# Altium project Elevate_pcb.PrjPcb
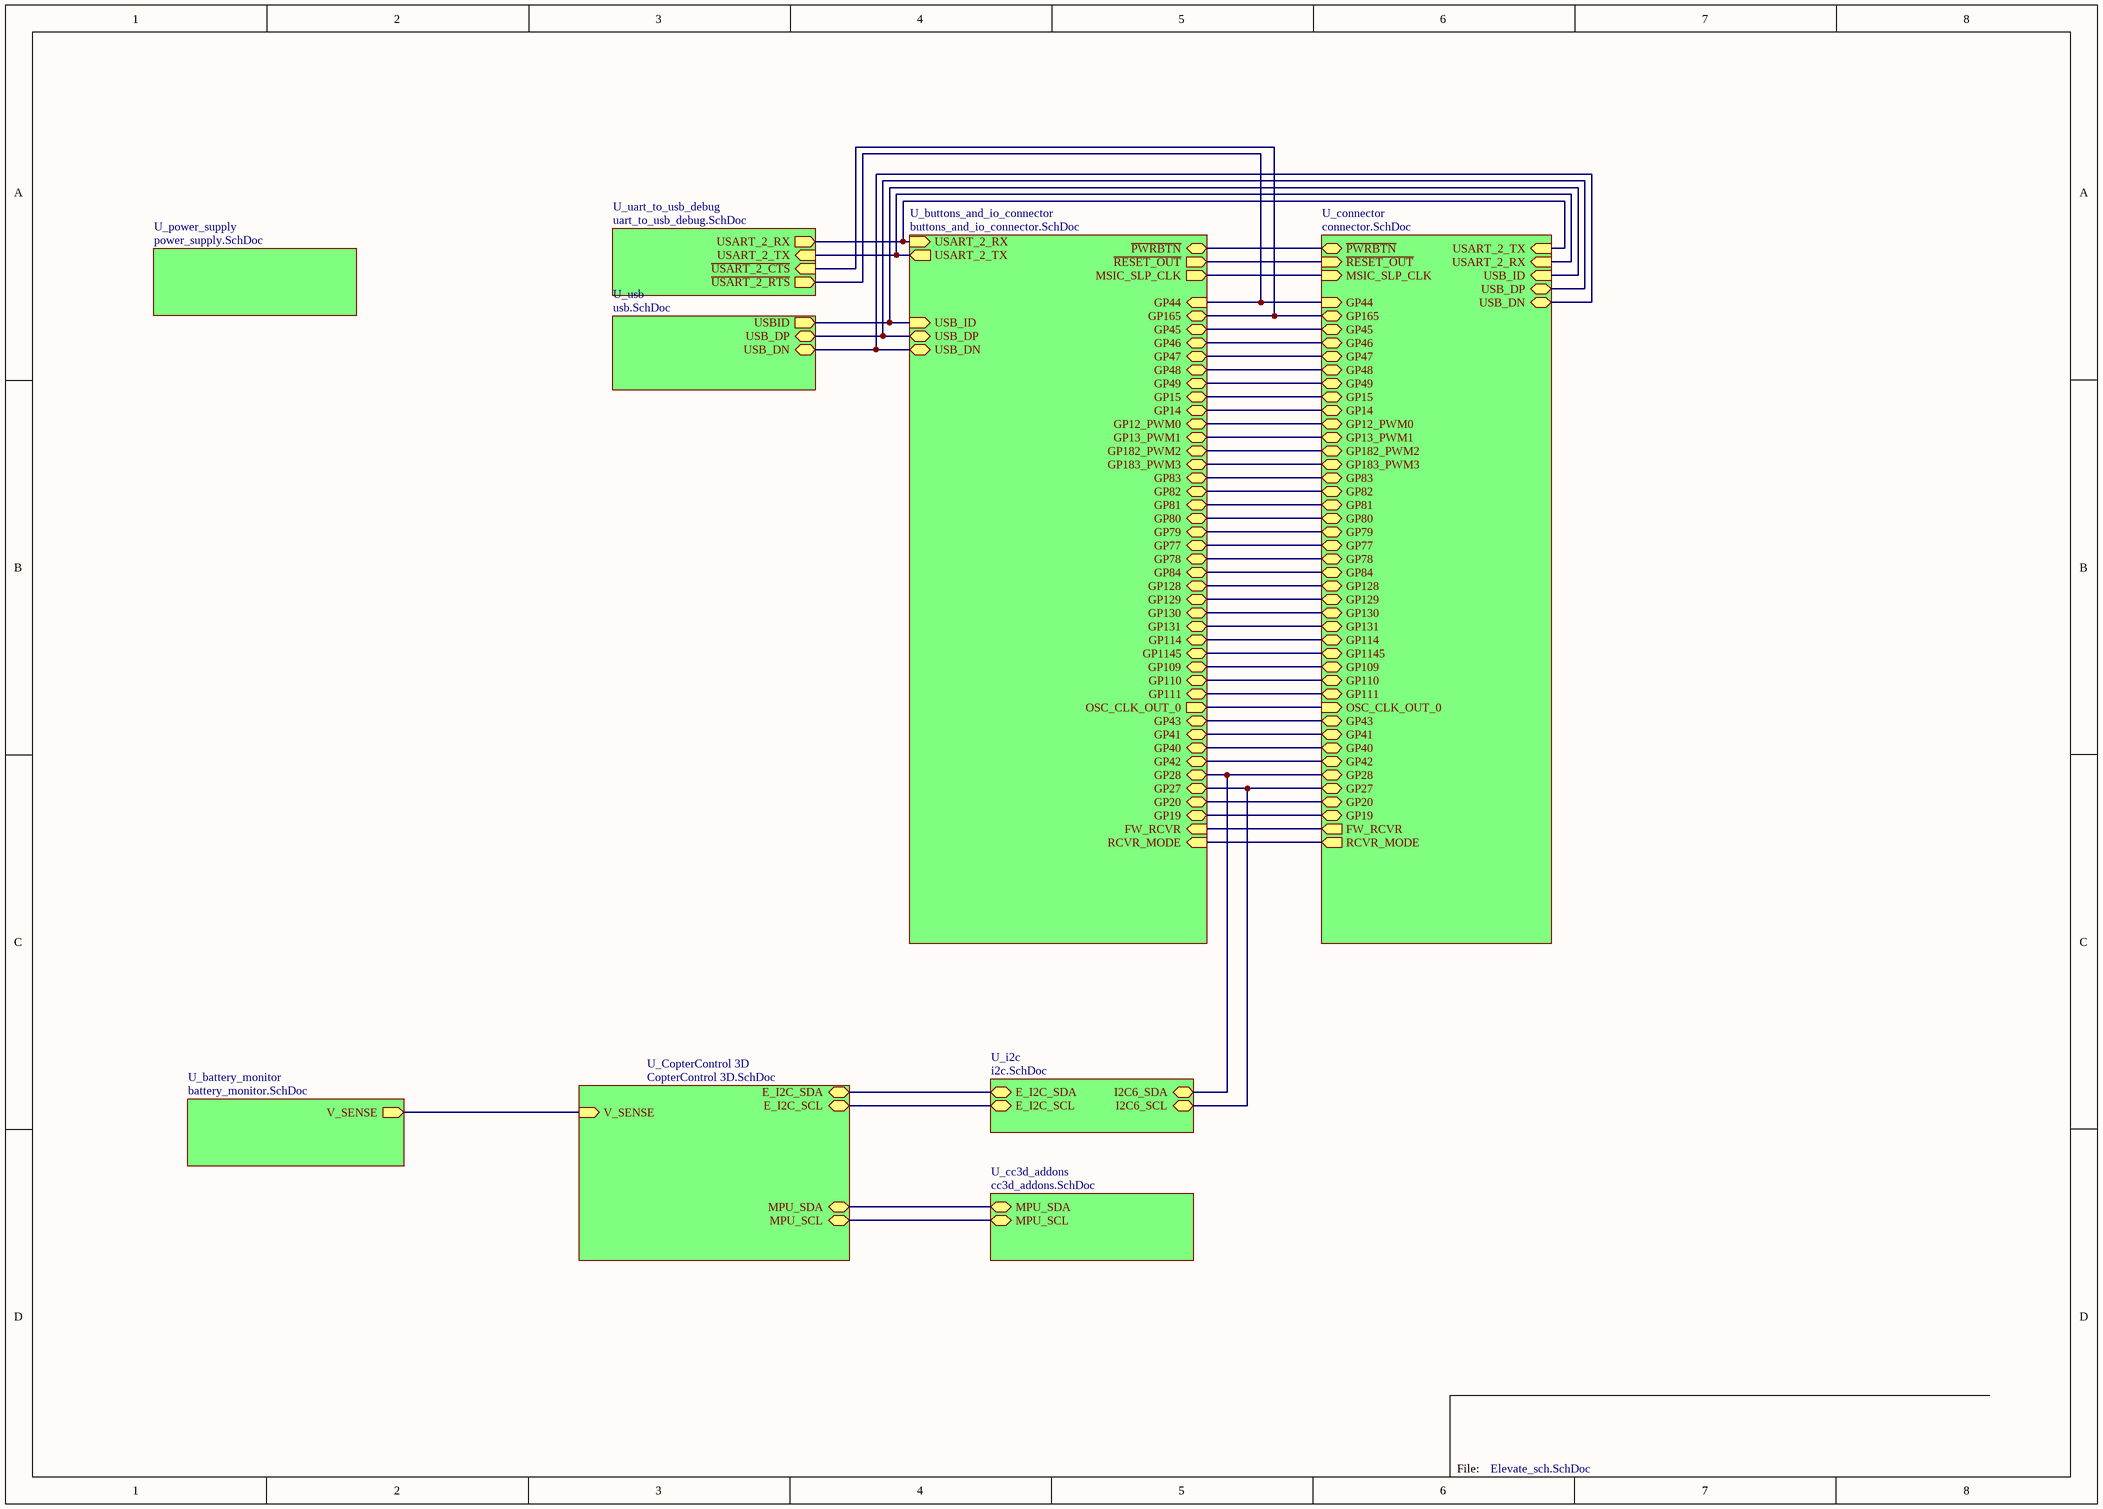
[diagram p0: Elevate_sch.SchDoc]
10 sheets, 115 parts. Net scope: hierarchical (ports join the sheet entries above them; power ports are global).
Board files: Elevate_sch.PcbDoc, Elevate_sch_bak.PcbDoc
Sheets:
  Elevate_sch.SchDoc
    U_buttons_and_io_connector = buttons_and_io_connector.SchDoc
    U_power_supply = power_supply.SchDoc
    U_uart_to_usb_debug = uart_to_usb_debug.SchDoc
    U_usb = usb.SchDoc
    U_connector = connector.SchDoc
    U_i2c = i2c.SchDoc
    U_CopterControl 3D = CopterControl 3D.SchDoc
    U_cc3d_addons = cc3d_addons.SchDoc
    U_battery_monitor = battery_monitor.SchDoc

## Sheet Elevate_sch.SchDoc: CopterControl 3D
size A3; Author: David Ankers; DrawnBy: David Ankers; Engineer: David Ankers; Organization: The OpenPilot Project; DocumentNumber: 1; Revision: A; SheetNumber: 1; SheetTotal: 1; License: Creative Commons BY-SA; ProjectName: OpenPilot

### Sub-sheets
U_battery_monitor = battery_monitor.SchDoc: V_SENSE (out)
U_buttons_and_io_connector = buttons_and_io_connector.SchDoc: USART_2_TX (out), USART_2_RX (in), USB_ID (in), USB_DP (bidir), USB_DN (bidir), ~{RESET_OUT} (out), MSIC_SLP_CLK (out), ~{PWRBTN} (bidir), GP44 (in), GP165 (bidir), GP45 (bidir), GP46 (bidir), GP47 (bidir), GP48 (bidir), GP49 (bidir), GP15 (bidir), GP14 (bidir), GP12_PWM0 (bidir), GP13_PWM1 (bidir), GP182_PWM2 (bidir), GP183_PWM3 (bidir), FW_RCVR (in), RCVR_MODE (in), OSC_CLK_OUT_0 (out), GP83 (bidir), GP82 (bidir), GP81 (bidir), GP80 (bidir), GP79 (bidir), GP77 (bidir), GP78 (bidir), GP84 (bidir), GP128 (bidir), GP129 (bidir), GP130 (bidir), GP131 (bidir), GP114 (bidir), GP1145 (bidir), GP109 (bidir), GP110 (bidir), GP111 (bidir), GP43 (bidir), GP41 (bidir), GP40 (bidir), GP42 (bidir), GP28 (bidir), GP27 (bidir), GP20 (bidir), GP19 (bidir)
U_cc3d_addons = cc3d_addons.SchDoc: MPU_SDA (bidir), MPU_SCL (bidir)
U_connector = connector.SchDoc: ~{PWRBTN} (bidir), ~{RESET_OUT} (in), MSIC_SLP_CLK (in), GP44 (in), GP165 (bidir), GP45 (bidir), GP46 (bidir), GP47 (bidir), GP48 (bidir), GP49 (bidir), GP15 (bidir), GP12_PWM0 (bidir), GP13_PWM1 (bidir), GP182_PWM2 (bidir), GP183_PWM3 (bidir), GP83 (bidir), GP82 (bidir), GP81 (bidir), GP80 (bidir), GP79 (bidir), GP77 (bidir), GP78 (bidir), GP84 (bidir), GP128 (bidir), GP129 (bidir), GP130 (bidir), GP131 (bidir), GP114 (bidir), GP1145 (bidir), GP109 (bidir), GP110 (bidir), GP111 (bidir), FW_RCVR (out), RCVR_MODE (out), OSC_CLK_OUT_0 (in), GP43 (bidir), GP41 (bidir), GP40 (bidir), GP42 (bidir), GP28 (bidir), GP27 (bidir), GP20 (bidir), GP19 (bidir), GP14 (bidir), USART_2_TX (in), USART_2_RX (in), USB_ID (in), USB_DP (bidir), USB_DN (bidir)
U_CopterControl 3D = CopterControl 3D.SchDoc: E_I2C_SDA (bidir), E_I2C_SCL (bidir), MPU_SCL (bidir), MPU_SDA (bidir), V_SENSE (in)
U_i2c = i2c.SchDoc: I2C6_SDA (bidir), I2C6_SCL (bidir), E_I2C_SDA (bidir), E_I2C_SCL (bidir)
U_power_supply = power_supply.SchDoc: no entries
U_uart_to_usb_debug = uart_to_usb_debug.SchDoc: USART_2_RX (out), USART_2_TX (in), ~{USART_2_CTS} (in), ~{USART_2_RTS} (out)
U_usb = usb.SchDoc: USB_DN (bidir), USB_DP (bidir), USBID (out)

### Nets
UART3_RX: sheet U_i2c/E_I2C_SDA, sheet U_CopterControl 3D/E_I2C_SDA
UART3_TX: sheet U_i2c/E_I2C_SCL, sheet U_CopterControl 3D/E_I2C_SCL
NetC2010_2: sheet U_buttons_and_io_connector/~{PWRBTN}, sheet U_connector/~{PWRBTN}
NetJ7_3: sheet U_buttons_and_io_connector/USB_ID, sheet U_usb/USBID, sheet U_connector/USB_ID
NetJ7_7: sheet U_buttons_and_io_connector/MSIC_SLP_CLK, sheet U_connector/MSIC_SLP_CLK
NetJ7_16: sheet U_buttons_and_io_connector/USB_DP, sheet U_usb/USB_DP, sheet U_connector/USB_DP
NetJ7_18: sheet U_buttons_and_io_connector/USB_DN, sheet U_usb/USB_DN, sheet U_connector/USB_DN
NetJ7_22: sheet U_buttons_and_io_connector/USART_2_RX, sheet U_uart_to_usb_debug/USART_2_RX, sheet U_connector/USART_2_TX
NetJ7_24: sheet U_buttons_and_io_connector/GP44, sheet U_uart_to_usb_debug/~{USART_2_RTS}, sheet U_connector/GP44
NetJ7_25: sheet U_buttons_and_io_connector/GP165, sheet U_uart_to_usb_debug/~{USART_2_CTS}, sheet U_connector/GP165
NetJ7_26: sheet U_buttons_and_io_connector/GP45, sheet U_connector/GP45
NetJ7_27: sheet U_buttons_and_io_connector/USART_2_TX, sheet U_uart_to_usb_debug/USART_2_TX, sheet U_connector/USART_2_RX
NetJ7_28: sheet U_buttons_and_io_connector/GP46, sheet U_connector/GP46
NetJ7_30: sheet U_buttons_and_io_connector/GP47, sheet U_connector/GP47
NetJ7_31: sheet U_buttons_and_io_connector/RCVR_MODE, sheet U_connector/RCVR_MODE
NetJ7_32: sheet U_buttons_and_io_connector/GP48, sheet U_connector/GP48
NetJ7_33: sheet U_buttons_and_io_connector/GP13_PWM1, sheet U_connector/GP13_PWM1
NetJ7_34: sheet U_buttons_and_io_connector/GP49, sheet U_connector/GP49
NetJ7_35: sheet U_buttons_and_io_connector/GP12_PWM0, sheet U_connector/GP12_PWM0
NetJ7_36: sheet U_buttons_and_io_connector/~{RESET_OUT}, sheet U_connector/~{RESET_OUT}
NetJ7_37: sheet U_buttons_and_io_connector/GP182_PWM2, sheet U_connector/GP182_PWM2
NetJ7_39: sheet U_buttons_and_io_connector/GP183_PWM3, sheet U_connector/GP183_PWM3
NetJ7_41: sheet U_buttons_and_io_connector/GP19, sheet U_connector/GP19
NetJ7_42: sheet U_buttons_and_io_connector/GP15, sheet U_connector/GP15
NetJ7_43: sheet U_buttons_and_io_connector/GP20, sheet U_connector/GP20
NetJ7_44: sheet U_buttons_and_io_connector/GP84, sheet U_connector/GP84
NetJ7_45: sheet U_buttons_and_io_connector/GP27, sheet U_connector/GP27, sheet U_i2c/I2C6_SCL
NetJ7_46: sheet U_buttons_and_io_connector/GP131, sheet U_connector/GP131
NetJ7_47: sheet U_buttons_and_io_connector/GP28, sheet U_connector/GP28, sheet U_i2c/I2C6_SDA
NetJ7_48: sheet U_buttons_and_io_connector/GP14, sheet U_connector/GP14
NetJ7_50: sheet U_buttons_and_io_connector/GP42, sheet U_connector/GP42
NetJ7_51: sheet U_buttons_and_io_connector/GP111, sheet U_connector/GP111
NetJ7_52: sheet U_buttons_and_io_connector/GP40, sheet U_connector/GP40
NetJ7_53: sheet U_buttons_and_io_connector/GP110, sheet U_connector/GP110
NetJ7_54: sheet U_buttons_and_io_connector/GP41, sheet U_connector/GP41
NetJ7_55: sheet U_buttons_and_io_connector/GP109, sheet U_connector/GP109
NetJ7_56: sheet U_buttons_and_io_connector/GP43, sheet U_connector/GP43
NetJ7_57: sheet U_buttons_and_io_connector/GP1145, sheet U_connector/GP1145
NetJ7_58: sheet U_buttons_and_io_connector/GP78, sheet U_connector/GP78
NetJ7_59: sheet U_buttons_and_io_connector/GP114, sheet U_connector/GP114
NetJ7_60: sheet U_buttons_and_io_connector/GP77, sheet U_connector/GP77
NetJ7_61: sheet U_buttons_and_io_connector/GP130, sheet U_connector/GP130
NetJ7_62: sheet U_buttons_and_io_connector/GP79, sheet U_connector/GP79
NetJ7_63: sheet U_buttons_and_io_connector/GP129, sheet U_connector/GP129
NetJ7_64: sheet U_buttons_and_io_connector/GP82, sheet U_connector/GP82
NetJ7_65: sheet U_buttons_and_io_connector/GP128, sheet U_connector/GP128
NetJ7_66: sheet U_buttons_and_io_connector/GP80, sheet U_connector/GP80
NetJ7_67: sheet U_buttons_and_io_connector/OSC_CLK_OUT_0, sheet U_connector/OSC_CLK_OUT_0
NetJ7_68: sheet U_buttons_and_io_connector/GP83, sheet U_connector/GP83
NetJ7_69: sheet U_buttons_and_io_connector/FW_RCVR, sheet U_connector/FW_RCVR
NetJ7_70: sheet U_buttons_and_io_connector/GP81, sheet U_connector/GP81
NetMG1_1: sheet U_CopterControl 3D/MPU_SCL, sheet U_cc3d_addons/MPU_SCL
NetMG1_16: sheet U_CopterControl 3D/MPU_SDA, sheet U_cc3d_addons/MPU_SDA
NetR2000_2: sheet U_CopterControl 3D/V_SENSE, sheet U_battery_monitor/V_SENSE

### Notes on the sheet
- File:

## Sheet buttons_and_io_connector.SchDoc
size 447 x 332 mm
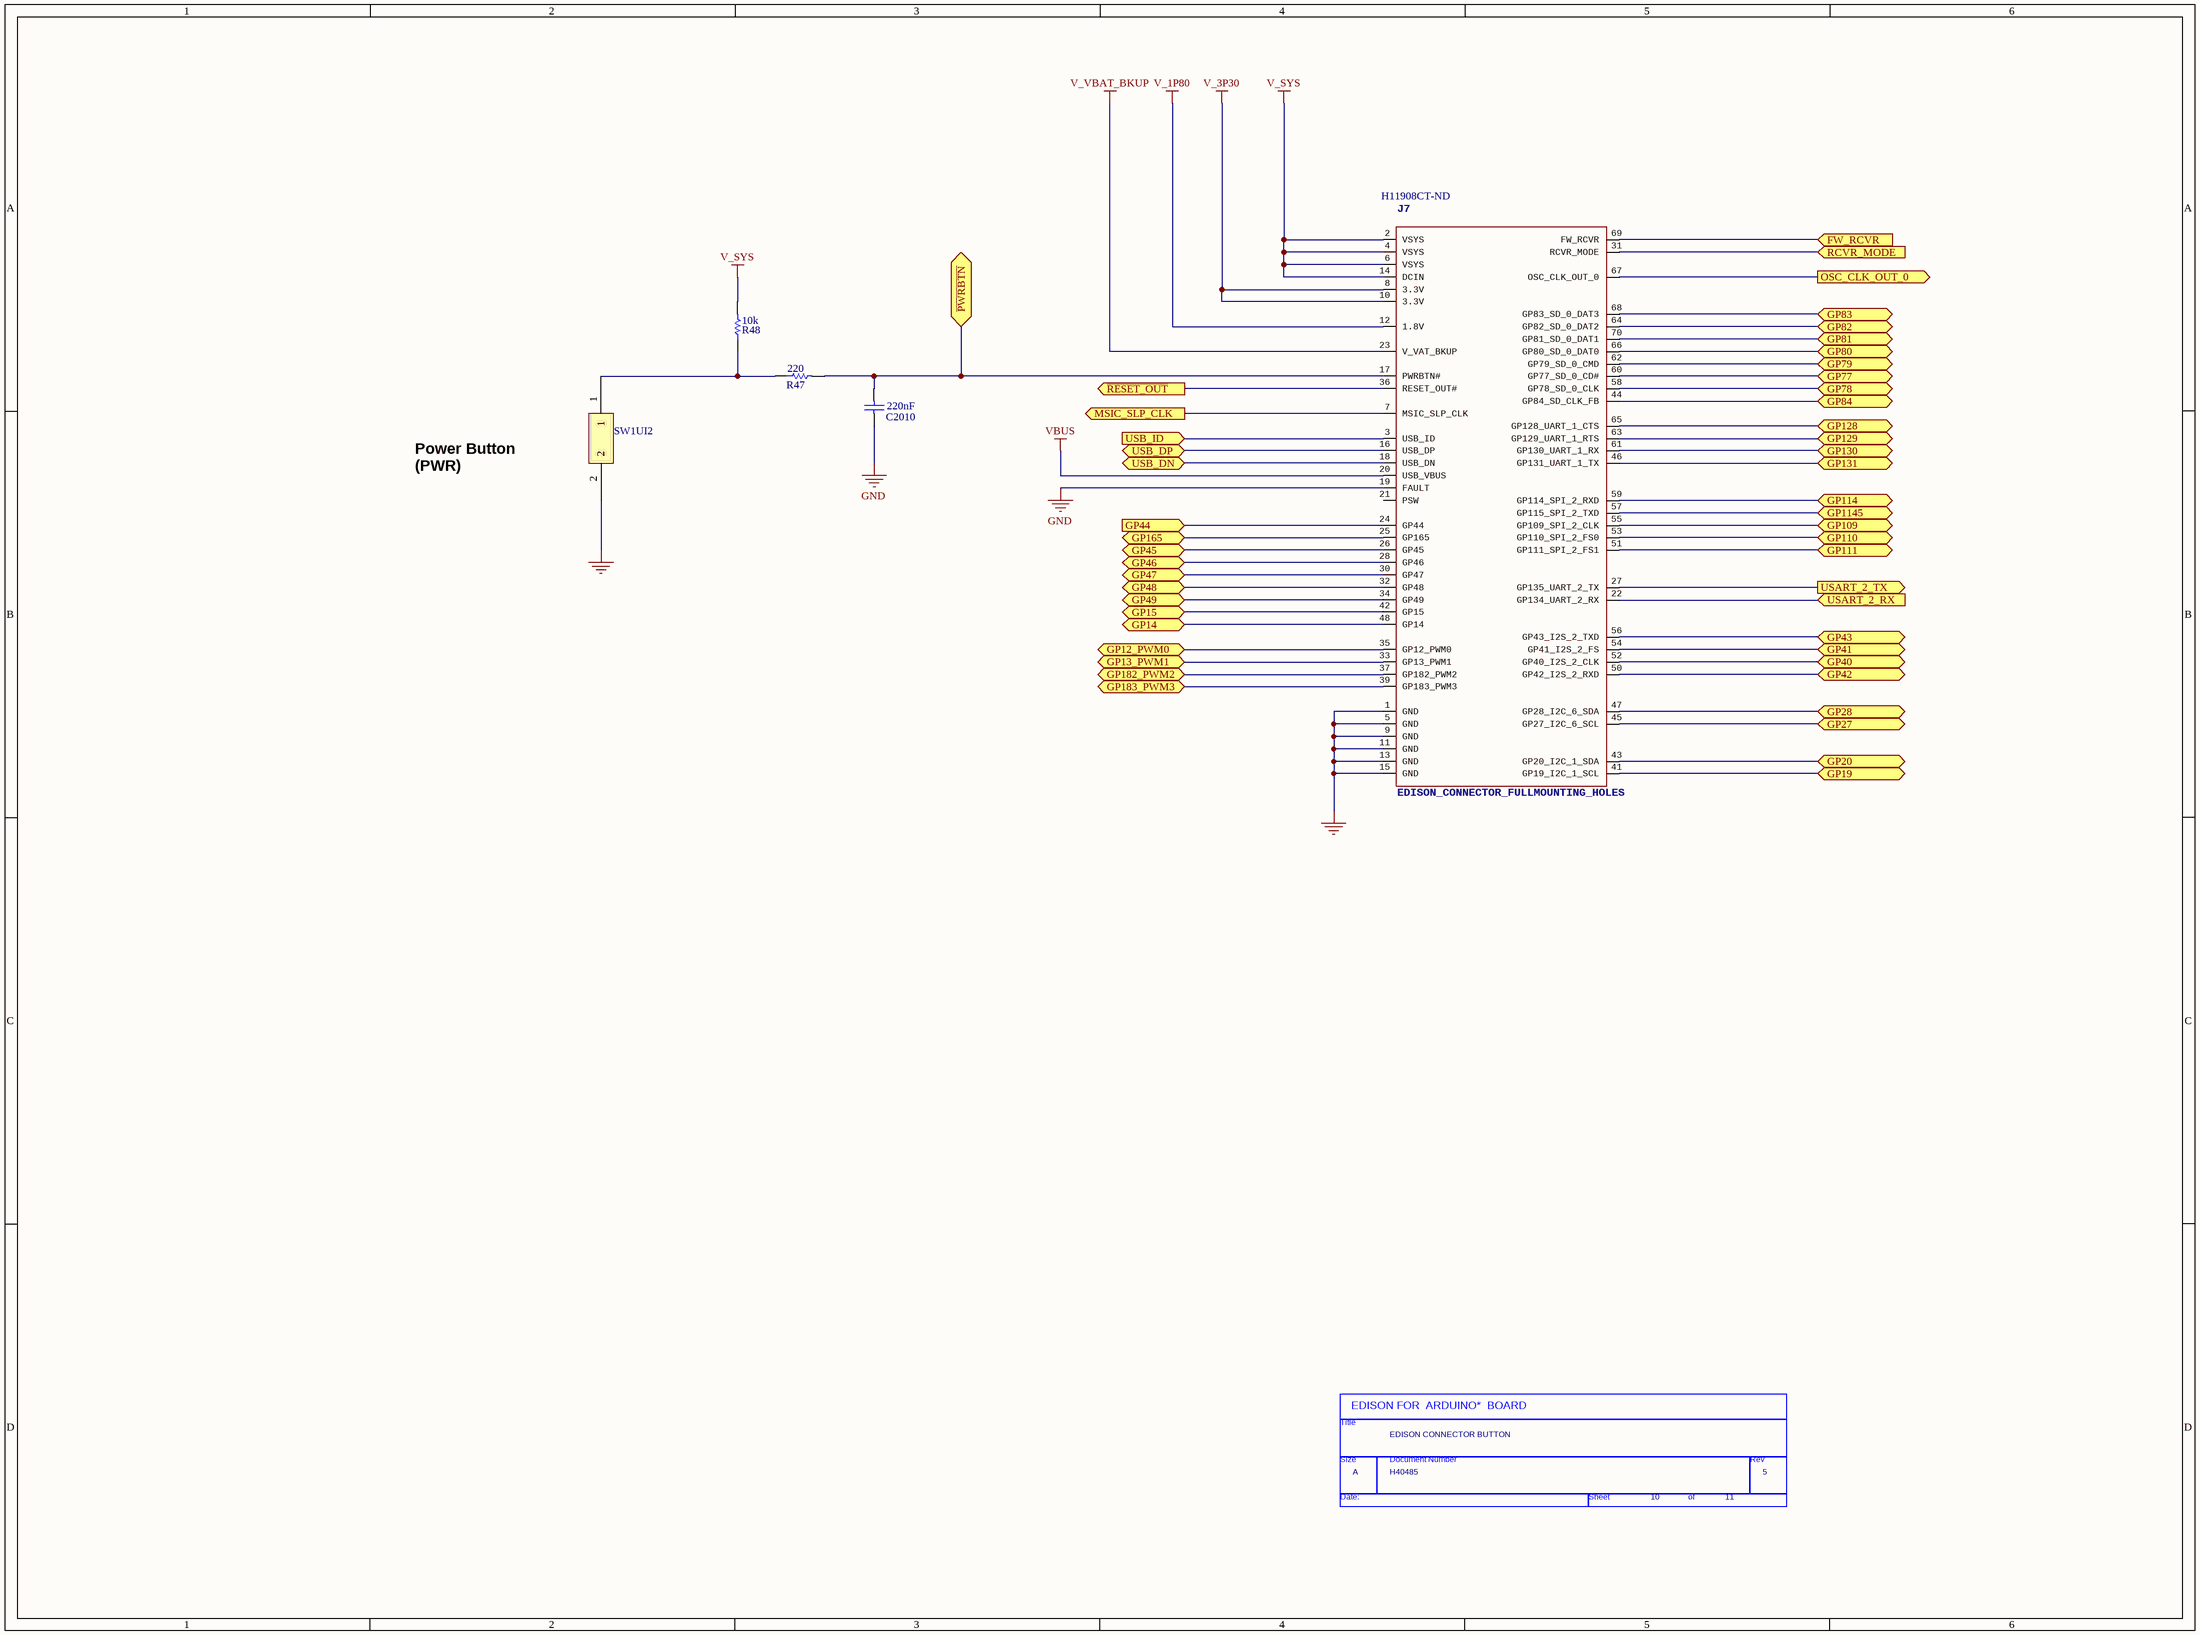
[diagram p1: buttons_and_io_connector.SchDoc]

### Parts
(Parts that share a designator on the sheet are numbered #1, #2 ... from top to bottom, then left to right.)
*#1  Page Count: 11  Page Number: 10  Page Size: A  Title: EDISON CONNECTOR BUTTON  RevCode: 5  Doc: H40485  (hidden comment: TitleBlock0)  (graphical)
C2010  value 220nF  [CAPC0805(2012)145_M]  (hidden comment: CAP 220nF 16V 0805(2012))
J7  EDISON_CONNECTOR_FULLMOUNTING_HOLES  Supplier Part Number 1: H11908CT-ND  [EDISON_DAUGHTER]
R47  value 220  [RESC0805(2012)_M]  (hidden comment: 220R 1% 0805(2012))
R48  value 10k  [RESC0805(2012)_M]  (hidden comment: 10K 1% 0805(2012))
SW1UI2  Tl1015AF160QG  [TL1015AF160QG]  (value not drawn)

### Ports
FW_RCVR (in), GP12_PWM0 (bidir), GP13_PWM1 (bidir), GP14 (bidir), GP15 (bidir), GP19 (bidir), GP20 (bidir), GP27 (bidir), GP28 (bidir), GP40 (bidir), GP41 (bidir), GP42 (bidir), GP43 (bidir), GP44 (in), GP45 (bidir), GP46 (bidir), GP47 (bidir), GP48 (bidir), GP49 (bidir), GP77 (bidir), GP78 (bidir), GP79 (bidir), GP80 (bidir), GP81 (bidir), GP82 (bidir), GP83 (bidir), GP84 (bidir), GP109 (bidir), GP110 (bidir), GP111 (bidir), GP114 (bidir), GP128 (bidir), GP129 (bidir), GP130 (bidir), GP131 (bidir), GP165 (bidir), GP182_PWM2 (bidir), GP183_PWM3 (bidir), GP1145 (bidir), MSIC_SLP_CLK (out), OSC_CLK_OUT_0 (out), RCVR_MODE (in), USART_2_RX (in), USART_2_TX (out), USB_DN (bidir), USB_DP (bidir), USB_ID (in), ~{PWRBTN} (bidir), ~{RESET_OUT} (out)

### Nets
GND: C2010.1 J7.1(GND) J7.5(GND) J7.9(GND) J7.11(GND) J7.13(GND) J7.15(GND) J7.19(FAULT) SW1UI2.2
V_1P80: J7.12(1.8V)
V_3P30: J7.8(3.3V) J7.10(3.3V)
V_SYS: J7.2(VSYS) J7.4(VSYS) J7.6(VSYS) J7.14(DCIN) R48.2
V_VBAT_BKUP: J7.23(V_VAT_BKUP)
VBUS: J7.20(USB_VBUS)
NetC2010_2: C2010.2 J7.17(PWRBTN#) R47.2 ; port ~{PWRBTN}
NetJ7_3: J7.3(USB_ID) ; port USB_ID
NetJ7_7: J7.7(MSIC_SLP_CLK) ; port MSIC_SLP_CLK
NetJ7_16: J7.16(USB_DP) ; port USB_DP
NetJ7_18: J7.18(USB_DN) ; port USB_DN
NetJ7_22: J7.22(GP134_UART_2_RX) ; port USART_2_RX
NetJ7_24: J7.24(GP44) ; port GP44
NetJ7_25: J7.25(GP165) ; port GP165
NetJ7_26: J7.26(GP45) ; port GP45
NetJ7_27: J7.27(GP135_UART_2_TX) ; port USART_2_TX
NetJ7_28: J7.28(GP46) ; port GP46
NetJ7_30: J7.30(GP47) ; port GP47
NetJ7_31: J7.31(RCVR_MODE) ; port RCVR_MODE
NetJ7_32: J7.32(GP48) ; port GP48
NetJ7_33: J7.33(GP13_PWM1) ; port GP13_PWM1
NetJ7_34: J7.34(GP49) ; port GP49
NetJ7_35: J7.35(GP12_PWM0) ; port GP12_PWM0
NetJ7_36: J7.36(RESET_OUT#) ; port ~{RESET_OUT}
NetJ7_37: J7.37(GP182_PWM2) ; port GP182_PWM2
NetJ7_39: J7.39(GP183_PWM3) ; port GP183_PWM3
NetJ7_41: J7.41(GP19_I2C_1_SCL) ; port GP19
NetJ7_42: J7.42(GP15) ; port GP15
NetJ7_43: J7.43(GP20_I2C_1_SDA) ; port GP20
NetJ7_44: J7.44(GP84_SD_CLK_FB) ; port GP84
NetJ7_45: J7.45(GP27_I2C_6_SCL) ; port GP27
NetJ7_46: J7.46(GP131_UART_1_TX) ; port GP131
NetJ7_47: J7.47(GP28_I2C_6_SDA) ; port GP28
NetJ7_48: J7.48(GP14) ; port GP14
NetJ7_50: J7.50(GP42_I2S_2_RXD) ; port GP42
NetJ7_51: J7.51(GP111_SPI_2_FS1) ; port GP111
NetJ7_52: J7.52(GP40_I2S_2_CLK) ; port GP40
NetJ7_53: J7.53(GP110_SPI_2_FS0) ; port GP110
NetJ7_54: J7.54(GP41_I2S_2_FS) ; port GP41
NetJ7_55: J7.55(GP109_SPI_2_CLK) ; port GP109
NetJ7_56: J7.56(GP43_I2S_2_TXD) ; port GP43
NetJ7_57: J7.57(GP115_SPI_2_TXD) ; port GP1145
NetJ7_58: J7.58(GP78_SD_0_CLK) ; port GP78
NetJ7_59: J7.59(GP114_SPI_2_RXD) ; port GP114
NetJ7_60: J7.60(GP77_SD_0_CD#) ; port GP77
NetJ7_61: J7.61(GP130_UART_1_RX) ; port GP130
NetJ7_62: J7.62(GP79_SD_0_CMD) ; port GP79
NetJ7_63: J7.63(GP129_UART_1_RTS) ; port GP129
NetJ7_64: J7.64(GP82_SD_0_DAT2) ; port GP82
NetJ7_65: J7.65(GP128_UART_1_CTS) ; port GP128
NetJ7_66: J7.66(GP80_SD_0_DAT0) ; port GP80
NetJ7_67: J7.67(OSC_CLK_OUT_0) ; port OSC_CLK_OUT_0
NetJ7_68: J7.68(GP83_SD_0_DAT3) ; port GP83
NetJ7_69: J7.69(FW_RCVR) ; port FW_RCVR
NetJ7_70: J7.70(GP81_SD_0_DAT1) ; port GP81
NetR47_1: R47.1 R48.1 SW1UI2.1

Not connected (* = marked no-connect by the designer): J7 21(PSW)

### Notes on the sheet
- (near SW1UI2) Power Button
  (PWR)
- (in symbol TitleBlock0) EDISON FOR  ARDUINO*  BOARD; Title; Size; Document Number; Rev; Date:; Sheet; of

### Library data of the parts
C2010 = CMP-1036-04533-1: CAP 220nF 16V ±10% 0805 (2012 Metric) Thickness 1.45mm SMD; Case-EIA: 0805; Case-Metric: 2012; Tolerance: ±10%; Max Thickness: 1.45 mm; Technology: SMT; Rated Voltage: 16 V; Supplier 1: Digi-Key; Supplier Part Number 1: 1276-1284-1-ND
R47 = CMP-1013-00433-1: 220R 0.125W 1% 0805 (2012 Metric)  SMD; Case-EIA: 0805; Case-Metric: 2012; Technology: SMT; Tolerance: 1 %; Power: 0.125 W; Supplier 1: Digi-Key; Supplier Part Number 1: 311-220CRCT-ND
R48 = CMP-1013-00623-1: 10K 0.125W 1% 0805 (2012 Metric)  SMD; Case-Metric: 2012; Case-EIA: 0805; Tolerance: 1 %; Power: 0.125 W; Technology: SMT; Supplier 1: Digi-Key; Supplier Part Number 1: 311-10.0KCRCT-ND
*#1 = TitleBlock0: Page Create Date: March  8, 1995
J7 = EDISON_CONNECTOR_FULLMOUNTING_HOLES: Supplier 1: Digi-Key
SW1UI2 = Tl1015AF160QG: Supplier 1: Digi-Key; Supplier Part Number 1: EG4344DKR-ND

## Sheet power_supply.SchDoc
size 447 x 332 mm
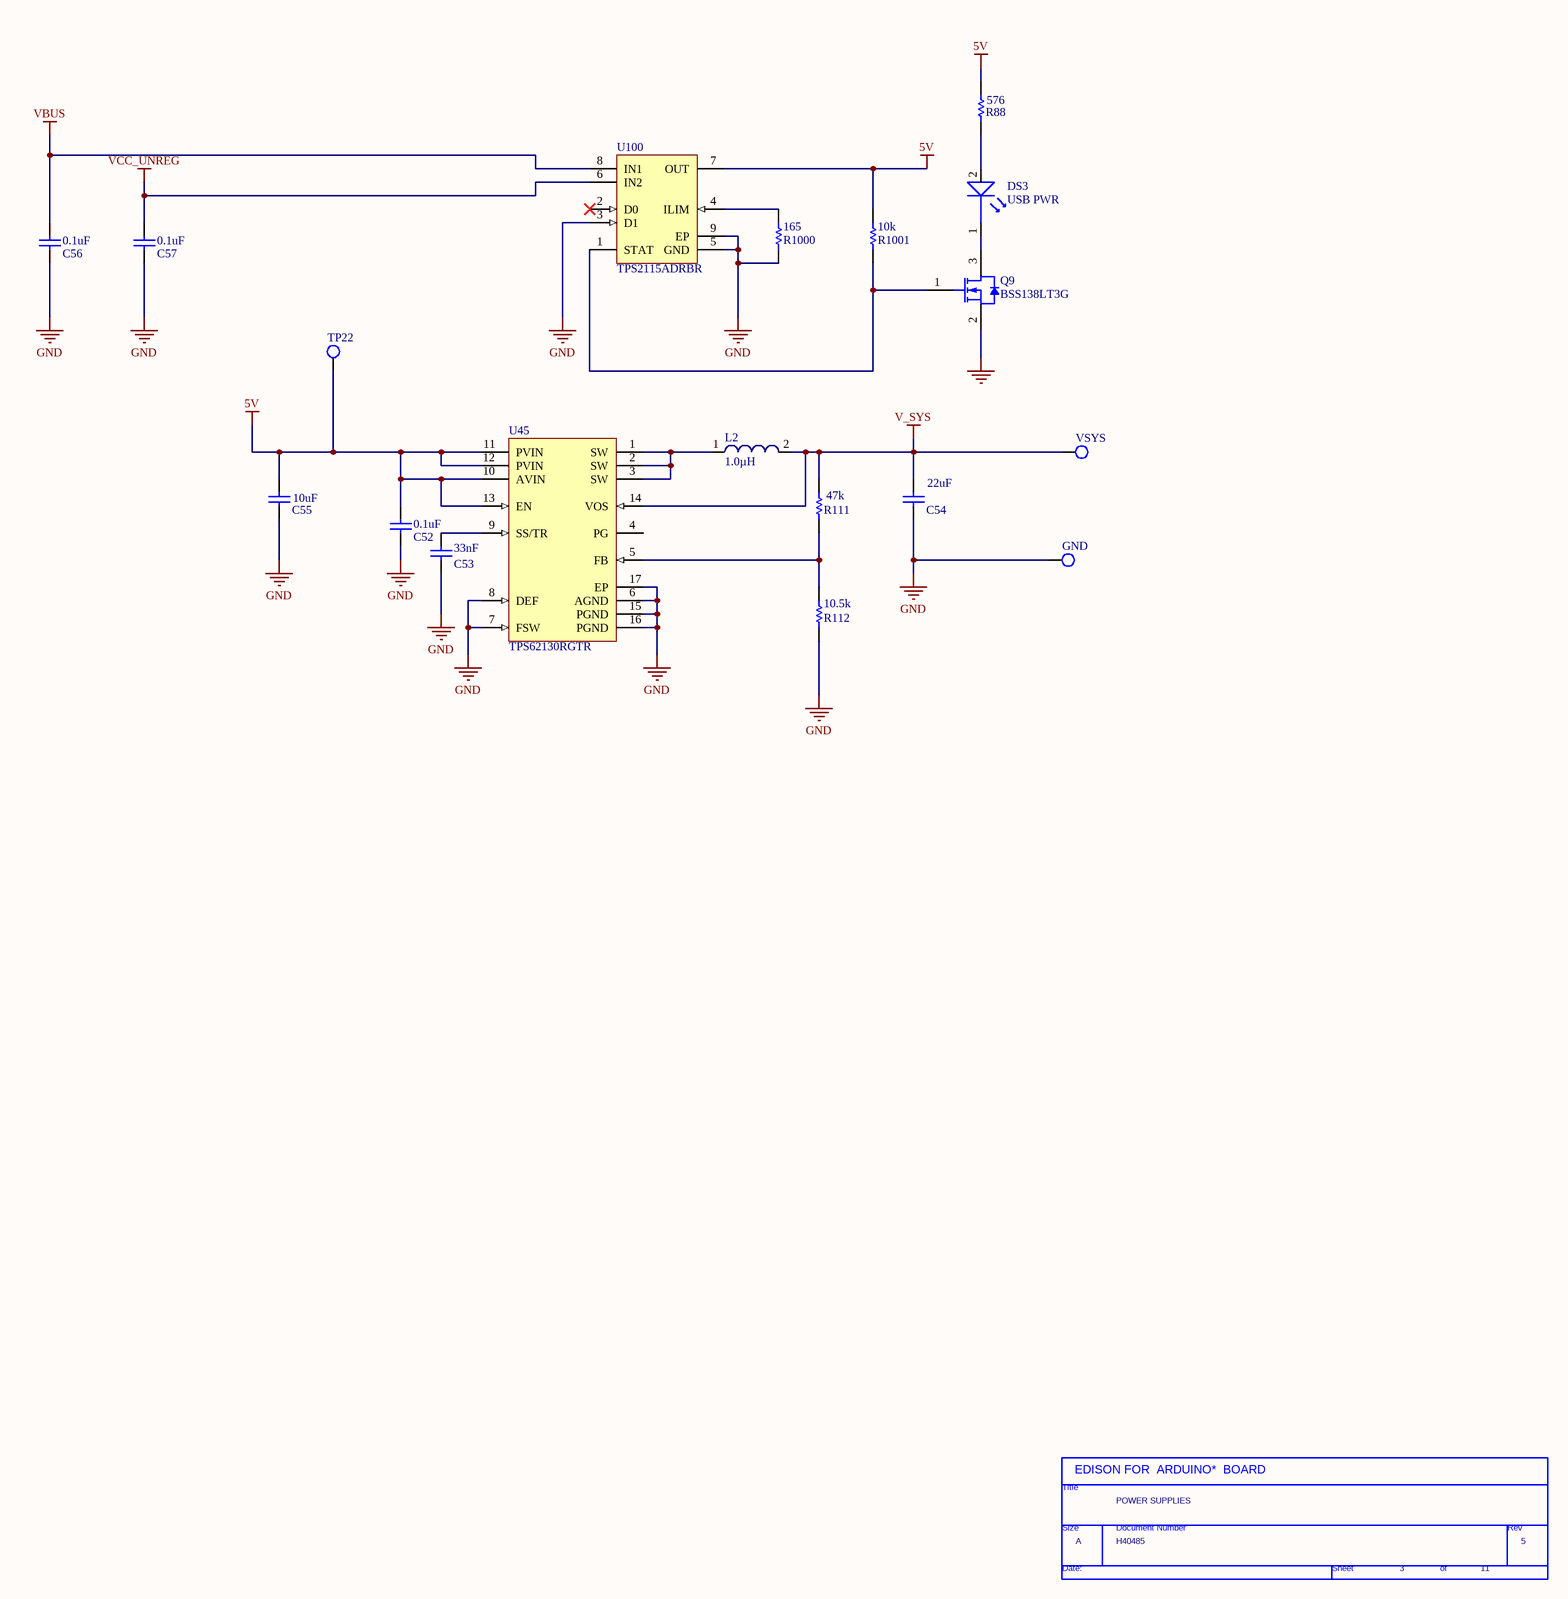
[diagram p2: power_supply.SchDoc]

### Parts
(Parts that share a designator on the sheet are numbered #1, #2 ... from top to bottom, then left to right.)
*#2  Page Count: 11  Page Number: 3  Page Size: A  Title: POWER SUPPLIES  RevCode: 5  Doc: H40485  (hidden comment: TitleBlock0)  (graphical)
C52  value 0.1uF  [CAPC0805(2012)145_L]  (hidden comment: CAP 100nF 16V 0805(2012))
C53  value 33nF  [CAPC0805(2012)145_L]  (hidden comment: CAP 33nF 50V 0805(2012))
C54  value 22uF  [CAPC0805(2012)145_M]  (hidden comment: CAP 22uF 6.3V 0805(2012))
C55  value 10uF  [CAPC0805(2012)145_L]  (hidden comment: CAP 820pF 25V 0805(2012))
C56  value 0.1uF  [CAPC0805(2012)145_L]  (hidden comment: CAP 100nF 16V 0805(2012))
C57  value 0.1uF  [CAPC0805(2012)145_L]  (hidden comment: CAP 100nF 16V 0805(2012))
DS3  USB PWR  [LTST-C281KGKT]
GND  Testpoint  [Tespoint_Keystone]  (value not drawn)  (no BOM)
L2  1.0µH  [SMD 2508]
Q9  BSS138LT3G  [ONSC-SOT-23-3-318-08_V]
R88  value 576  [RESC0603(1608)_N]  (hidden comment: 576R 1% 0603(1608))
R111  value 47k  [RESC0603(1608)_N]  (hidden comment: 47K 1% 0603(1608))
R112  value 10.5k  [RESC0603(1608)_N]  (hidden comment: 10K5 1% 0603(1608))
R1000  value 165  [RESC0805(2012)_L]  (hidden comment: 165R 1% 0805(2012))
R1001  value 10k  [RESC0805(2012)_M]  (hidden comment: 10K 1% 0805(2012))
TP22  Testpoint  [Tespoint_Keystone]  (value not drawn)  (no BOM)
U45  TPS62130RGTR  [RGT16-1700X1700TP]
U100  TPS2115ADRBR  [DRB8-2400X1650TP]
VSYS  Testpoint  [Tespoint_Keystone]  (value not drawn)  (no BOM)

### Nets
5V: C52.1 C55.2 R88.2 R1001.2 TP22.1(TP) U45.10(AVIN) U45.11(PVIN) U45.12(PVIN) U45.13(EN) U100.7(OUT)
GND: C52.2 C53.1 C54.1 C55.1 C56.2 C57.2 GND.1(TP) Q9.2(S) R112.1 R1000.1 U45.6(AGND) U45.7(FSW) U45.8(DEF) U45.15(PGND) U45.16(PGND) U45.17(EP) U100.3(D1) U100.5(GND) U100.9(EP)
V_SYS: C54.2 L2.2 R111.2 U45.14(VOS) VSYS.1(TP)
VBUS: C56.1 U100.8(IN1)
VCC_UNREG: C57.1 U100.6(IN2)
NetC53_2: C53.2 U45.9(SS/TR)
NetDS3_1: DS3.1(LED1) Q9.3(D)
NetDS3_2: DS3.2(LED2) R88.1
NetL2_1: L2.1 U45.1(SW) U45.2(SW) U45.3(SW)
NetQ9_1: Q9.1(G) R1001.1 U100.1(STAT)
NetR111_1: R111.1 R112.2 U45.5(FB)
NetR1000_2: R1000.2 U100.4(ILIM)

Not connected (* = marked no-connect by the designer): U45 4(PG); U100 2(D0)*

### Notes on the sheet
- (in symbol TitleBlock0) EDISON FOR  ARDUINO*  BOARD; Title; Size; Document Number; Rev; Date:; Sheet; of

### Library data of the parts
C52 C56 C57 = CMP-1036-04401-1: CAP 100nF 16V ±10% 0805 (2012 Metric) Thickness 1.45mm SMD; Case-Metric: 2012; Case-EIA: 0805; Max Thickness: 1.45 mm; Technology: SMT; Tolerance: ±10%; Rated Voltage: 16 V; Supplier 1: Digi-Key; Supplier Part Number 1: 311-1142-1-ND
C53 = CMP-1036-04168-1: CAP 33nF 50V ±10% 0805 (2012 Metric) Thickness 1.45mm SMD; Case-Metric: 2012; Case-EIA: 0805; Max Thickness: 1.45 mm; Rated Voltage: 50 V; Tolerance: ±10%; Technology: SMT; Supplier 1: Digi-Key; Supplier Part Number 1: 311-1131-1-ND
C54 = CMP-1036-04939-1: CAP 22uF 6.3V ±20% 0805 (2012 Metric) Thickness 1.45mm SMD; Case-EIA: 0805; Case-Metric: 2012; Max Thickness: 1.45 mm; Technology: SMT; Rated Voltage: 6.3 V; Tolerance: ±20%; Supplier 1: Digi-Key; Supplier Part Number 1: 311-1464-1-ND
C55 = CMP-1036-02893-1: CAP 820pF 25V ±10% 0805 (2012 Metric) Thickness 1.45mm SMD; Case-Metric: 2012; Case-EIA: 0805; Tolerance: ±10%; Technology: SMT; Max Thickness: 1.35 mm; Rated Voltage: 25 V; Supplier 1: Digi-Key; Supplier Part Number 1: 490-5523-6-ND
DS3 = LED_Edison: Supplier 1: Digi-Key; Supplier Part Number 1: VLMG1500-GS08CT-ND
L2 = WE-MAPI 2508 ,74438322010: Power Multilayer Inductor WE-MAPI, L=1.0µH; Manufacturer: Würth Elektronik eiSos GmbH; partNo: 74438322010; Inductance: 1.0µH; ComponentLink1Description: Manufacturer; ComponentLink1URL: http://www.we-online.de; Created by: Otto Christin; Created Date: Nov 2013; ComponentLink2Description: Datasheet; ComponentLink2URL: http://katalog.we-online.de/kataloge/eisos/media/pdf/74438322010.pdf; Supplier 1: Digi-Key; Supplier Part Number 1: 732-4768-6-ND
Q9 = CMP-1058-00765-1: Power MOSFET, 200 mA, 50 V, N-Channel, 3-Pin SOT-23, Pb-Free, Tape and Reel; Manufacturer: On Semiconductor; PD Max (W): 0.225; Channel Polarity: N Channel; Crss Typ (pF): 3.5; Configuration: Single; ID Max (A): 0.2; Ciss Typ (pF): 40; V(BR)DSS Min (V): 50; VGS(th) Max (V): 1.5; Coss Typ (pF): 12; VGS Max (V): 20; ComponentLink2URL: http://www.onsemi.com/pub_link/Collateral/BSS138LT1-D.PDF; PackageDescription: 3-Pin Small Outline Transistor, Body 2.92 x 1.3 mm, Pitch 0.95 mm; Package Type: SOT-23-3; Mounting Technology: Surface Mount; ComponentLink1Description: Manufacturer URL; PackageVersion: Rev. AP, 11/2009; ComponentLink3Description: Package Specification; DatasheetVersion: Rev. 8; RoHS: Pb-Free; Packing: Tape and Reel; PackageReference: SOT-23-3-318-08; PartNumber: BSS138LT3G; ComponentLink3URL: http://www.onsemi.cn/pub_link/Collateral/318-08.PDF; ComponentLink1URL: http://www.onsemi.com/; ComponentLink2Description: Datasheet; Supplier 1: Digi-Key; Supplier Part Number 1: BSS138LT1GOSCT-ND
R88 = CMP-1012-00483-1: 576R 0.1W 1% 0603 (1608 Metric)  SMD; Case-Metric: 1608; Case-EIA: 0603; Tolerance: 1 %; Power: 0.1 W; Technology: SMT; Supplier 1: Digi-Key; Supplier Part Number 1: 311-576HRCT-ND
R111 = CMP-1012-00699-1: 47K 0.1W 1% 0603 (1608 Metric)  SMD; Case-Metric: 1608; Case-EIA: 0603; Technology: SMT; Power: 0.1 W; Tolerance: 1 %; Supplier 1: Digi-Key; Supplier Part Number 1: 311-47.0KHRCT-ND
R112 = CMP-1012-00625-1: 10K5 0.1W 1% 0603 (1608 Metric)  SMD; Case-EIA: 0603; Case-Metric: 1608; Power: 0.1 W; Technology: SMT; Tolerance: 1 %; Supplier 1: Digi-Key; Supplier Part Number 1: 311-10.5KHRCT-ND
R1000 = CMP-1013-00420-1: 165R 0.125W 1% 0805 (2012 Metric)  SMD; Case-Metric: 2012; Case-EIA: 0805; Tolerance: 1 %; Technology: SMT; Power: 0.125 W; Supplier 1: Digi-Key; Supplier Part Number 1: 311-165CRCT-ND
R1001 = CMP-1013-00623-1: as R48 on sheet buttons_and_io_connector; Tolerance: 1 %; Power: 0.125 W; Technology: SMT; Supplier 1: Digi-Key; Supplier Part Number 1: 311-10.0KCRCT-ND
U45 = CMP-0323-00115-2: Buck Step Down Regulator with 3 to 17 V Input and 0.9 to 6 V Output, -40 to 85 degC, 16-Pin QFN (RGT), Green (RoHS & no Sb/Br); Manufacturer: Texas Instruments; Vout(Min)(V): 0.9; SubFamily: Step-Down Regulator; Regulated Outputs(#): 1; Switch Current Limit(Typ)(A): 4.2; Vout(Max)(V): 6; Synchronous Rectification: TRUE; Vin(Min)(V): 3; Vin(Max)(V): 17; Iq(Typ)(mA): 0.017; Rating: Catalog; Duty Cycle(Max)(%): 100; ComponentLink1URL: http://www.ti.com/general/docs/lit/getliterature.tsp?genericPartNumber=TPS62130&fileType=pdf; ComponentLink1Description: Datasheet; ComponentLink2URL: http://www.ti.com/litv/pdf/mpqf119g; PartNumber: TPS62130RGTR; ComponentLink3Description: URL Link1; ComponentLink2Description: Package Specification; DatasheetVersion: SLVSAG7; Mounting Technology: Surface Mount; Code_JEDEC: MO-220; PackageReference: RGT16-1700X1700TP; Topology: Buck; ComponentLink3URL: Samples URL:http://www.ti.com/product/tps62130#samples; Eco-Plan: Green (RoHS & no Sb/Br); PackageVersion: revH, Oct-2011; Iout(Max)(A): 3; PackageDescription: 16-Pin Plastic Quad Flat No-Lead, 3 x 3 mm Body, 0.5 mm Pitch, 1.7 x 1.7 mm Exposed Pad; Supplier 1: Digi-Key; Supplier Part Number 1: 296-37682-6-ND
U100 = TPS2115ADRBR: Dual In / Single Out Autoswitching Power Mux, 2.8 to 5.5 V, -40 to 85 degC, 8-pin SON (DRB), Green (RoHS & no Sb/Br); Manufacturer: Texas Instruments; IN1 Output Current(Max)(A): 1.25; IN1 rDS(on)(Typ)(mOhm): 84; IN1, IN2 Input Voltage(Max)(V): 5.5; IN1, IN2 Input Voltage(Min)(V): 2.8; IN2 rDS(on)(Typ)(Ohms): 0.084; Number of Inputs: 2; SubFamily: Power Multiplexer (MUX); DatasheetVersion: SBVS044F; PackageVersion: revK, Jun-2012; PackageReference: DRB8-2400X1650TP; PackageDescription: 8-Pin Plastic Small Outline No-Lead, 3 x 3 x 1 mm Body, 0.65 mm Pitch, Exposed Pad; Supplier 1: Digi-Key; Supplier Part Number 1: 296-23394-1-ND; Supplier 2: Newark; Supplier Part Number 2: 99M6394; Eco-Plan: Green (RoHS & no Sb/Br); IN2 Output Current(Max)(A): 1.25; Mounting Technology: Surface Mount; PartNumber: TPS2115ADRBR; ComponentLink1Description: Datasheet; ComponentLink1URL: http://www.ti.com/general/docs/lit/getliterature.tsp?genericPartNumber=TPS2115A&fileType=pdf
*#2 = TitleBlock0: Page Create Date: March  8, 1995
GND TP22 VSYS = TestPoint: Supplier 1: Digi-Key; Supplier Part Number 1: 5000K-ND

## Sheet uart_to_usb_debug.SchDoc
size 386 x 246 mm
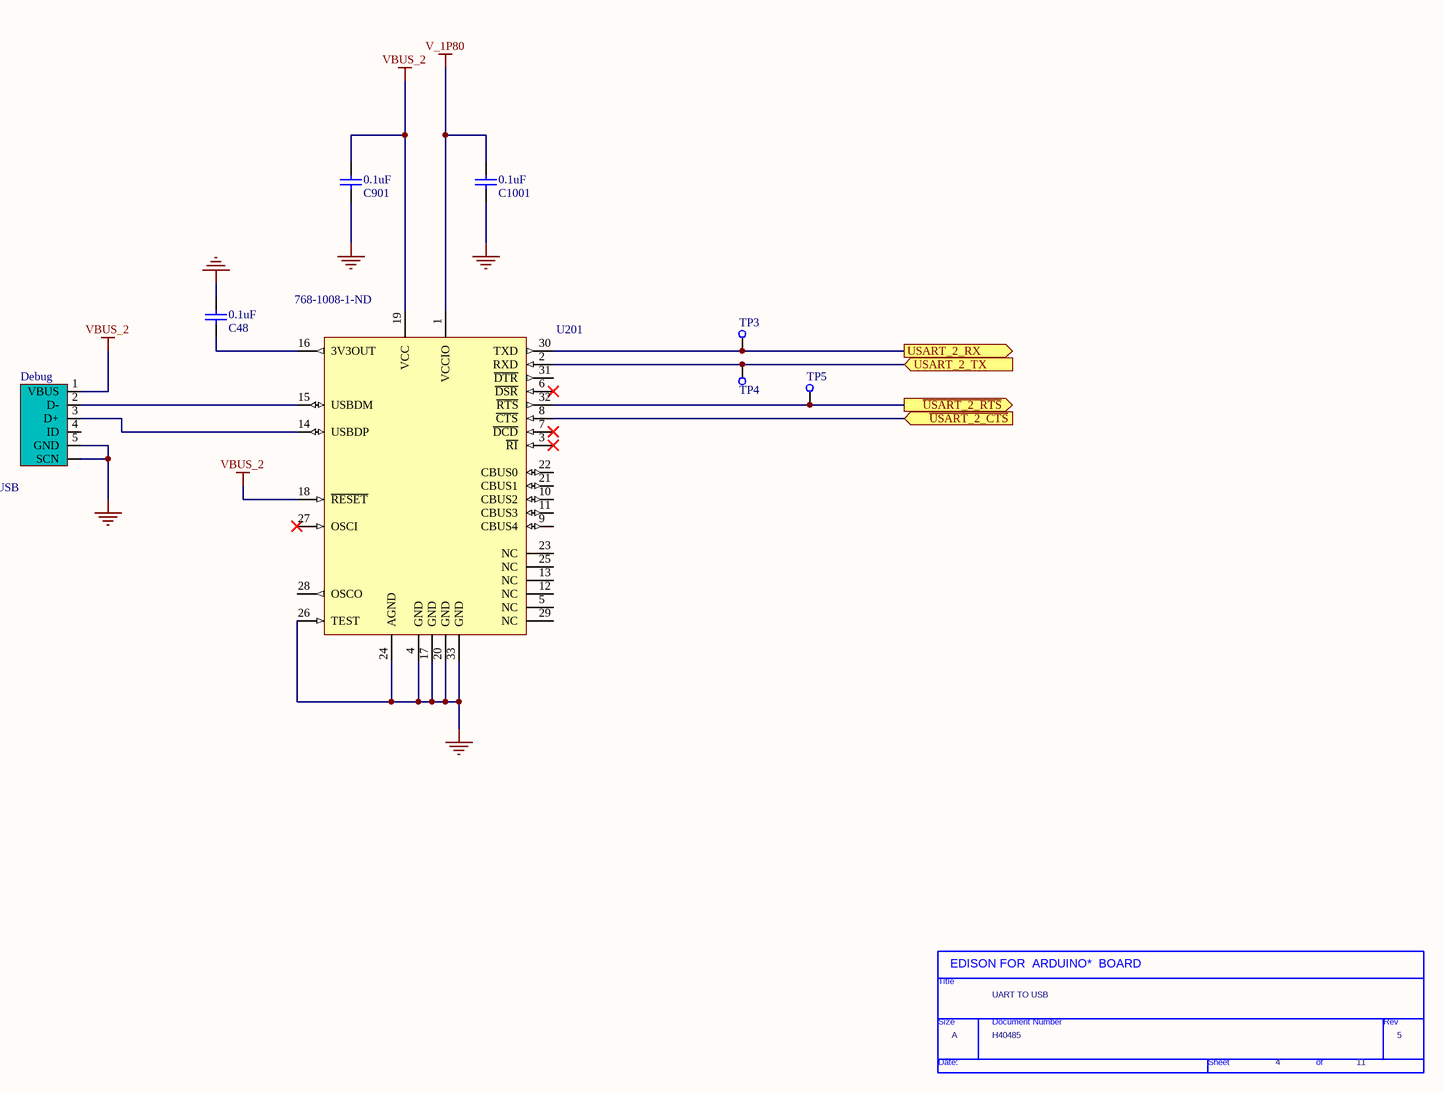
[diagram p3: uart_to_usb_debug.SchDoc]

### Parts
(Parts that share a designator on the sheet are numbered #1, #2 ... from top to bottom, then left to right.)
*#3  Page Count: 11  Page Number: 4  Page Size: A  Title: UART TO USB  RevCode: 5  Doc: H40485  (hidden comment: TitleBlock0)  (graphical)
C48  value 0.1uF  [CAPC0805(2012)145_L]  (hidden comment: CAP 100nF 16V 0805(2012))
C901  value 0.1uF  [CAPC0805(2012)145_L]  (hidden comment: CAP 100nF 16V 0805(2012))
C1001  value 0.1uF  [CAPC0805(2012)145_L]  (hidden comment: CAP 100nF 16V 0805(2012))
Debug  USB  [USB SMD]
TP3  TestPoint  [Testpoint]  (value not drawn)  (no BOM)
TP4  TestPoint  [Testpoint]  (value not drawn)  (no BOM)
TP5  Testpoint  [Testpoint]  (value not drawn)  (no BOM)
U201  Supplier Part Number 1: 768-1008-1-ND  [PQFN5X5-32_V]  (hidden comment: FT232RQ-Reel)

### Ports
USART_2_RX (out), USART_2_TX (in), ~{USART_2_CTS} (in), ~{USART_2_RTS} (out)

### Nets
GND: C48.1 C901.2 C1001.2 Debug.0(SCN) Debug.5(GND) U201.4(GND) U201.17(GND) U201.20(GND) U201.24(AGND) U201.26(TEST) U201.33(GND)
V_1P80: C1001.1 U201.1(VCCIO)
VBUS_2: C901.1 Debug.1(VBUS) U201.18(~{RESET}) U201.19(VCC)
NetC48_2: C48.2 U201.16(3V3OUT)
NetDebug_2: Debug.2(D-) U201.15(USBDM)
NetDebug_3: Debug.3(D+) U201.14(USBDP)
NetJ7_22: TP3.1(TP) U201.30(TXD) ; port USART_2_RX
NetJ7_24: TP5.1(TP) U201.32(~{RTS}) ; port ~{USART_2_RTS}
NetJ7_25: U201.8(~{CTS}) ; port ~{USART_2_CTS}
NetJ7_27: TP4.1(TP) U201.2(RXD) ; port USART_2_TX

Not connected (* = marked no-connect by the designer): Debug 4(ID); U201 3(~{RI})* 5(NC) 6(~{DSR})* 7(~{DCD})* 9(CBUS4) 10(CBUS2) 11(CBUS3) 12(NC) 13(NC) 21(CBUS1) 22(CBUS0) 23(NC) 25(NC) 27(OSCI)* 28(OSCO) 29(NC) 31(~{DTR})

### Notes on the sheet
- (in symbol TitleBlock0) EDISON FOR  ARDUINO*  BOARD; Title; Size; Document Number; Rev; Date:; Sheet; of

### Library data of the parts
C48 C901 C1001 = CMP-1036-04401-1: as C52 on sheet power_supply; Max Thickness: 1.45 mm; Technology: SMT; Tolerance: ±10%; Rated Voltage: 16 V; Supplier 1: Digi-Key; Supplier Part Number 1: 311-1142-1-ND
Debug = USB_SMT_B: USB Type-B SMT Socket; Class: Connector; Supplier 1: Digi-Key; Supplier Part Number 1: 670-1190-1-ND
U201 = CMP-0078-00009-1: USB UART Asynchronous Serial Data Transfer Chip, QFN-32, Tape and Reel; PackageDescription: 32-Pin Quad Flat No-Lead 0.5 mm Pitch, Pullback, 3.2 x 3.2 mm Exposed Pad; DatasheetVersion: ver 2.07, Jul-2010; PackageVersion: 2010; PackageReference: PQFN5X5-32; Supplier 1: Digi-Key
*#3 = TitleBlock0: Page Create Date: March  8, 1995

## Sheet usb.SchDoc
size 447 x 332 mm
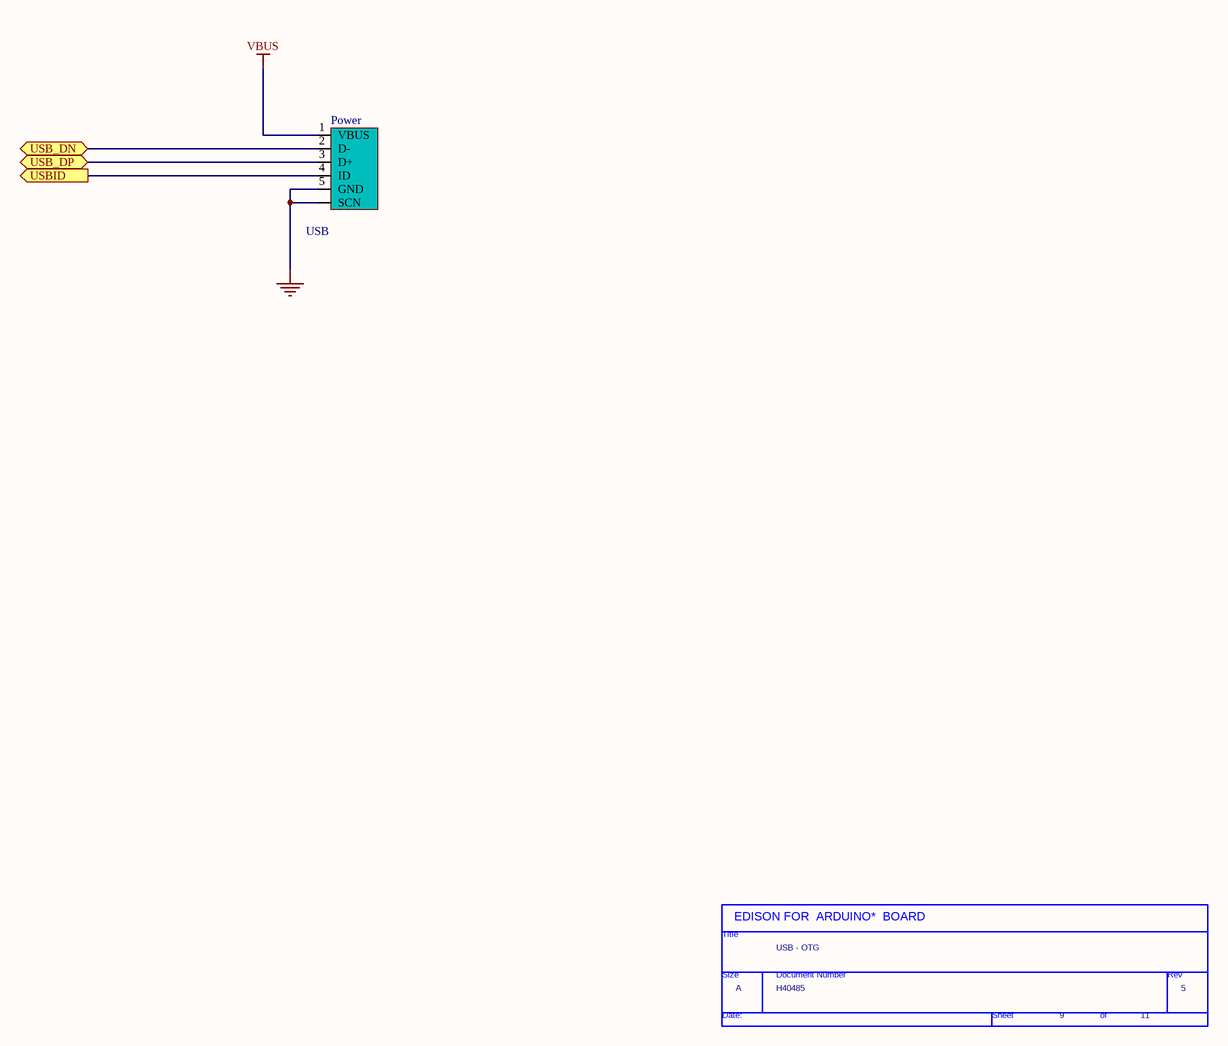
[diagram p4: usb.SchDoc]

### Parts
(Parts that share a designator on the sheet are numbered #1, #2 ... from top to bottom, then left to right.)
*#4  Page Count: 11  Page Number: 9  Page Size: A  Title: USB - OTG  RevCode: 5  Doc: H40485  (hidden comment: TitleBlock0)  (graphical)
Power  USB  [USB SMD]

### Ports
USB_DN (bidir), USB_DP (bidir), USBID (out)

### Nets
GND: Power.0(SCN) Power.5(GND)
VBUS: Power.1(VBUS)
NetJ7_3: Power.4(ID) ; port USBID
NetJ7_16: Power.3(D+) ; port USB_DP
NetJ7_18: Power.2(D-) ; port USB_DN

### Notes on the sheet
- (in symbol TitleBlock0) EDISON FOR  ARDUINO*  BOARD; Title; Size; Document Number; Rev; Date:; Sheet; of

### Library data of the parts
Power = USB_SMT_B: USB Type-B SMT Socket; Class: Connector; Supplier 1: Digi-Key; Supplier Part Number 1: 670-1190-1-ND
*#4 = TitleBlock0: Page Create Date: March  8, 1995

## Sheet connector.SchDoc
size A
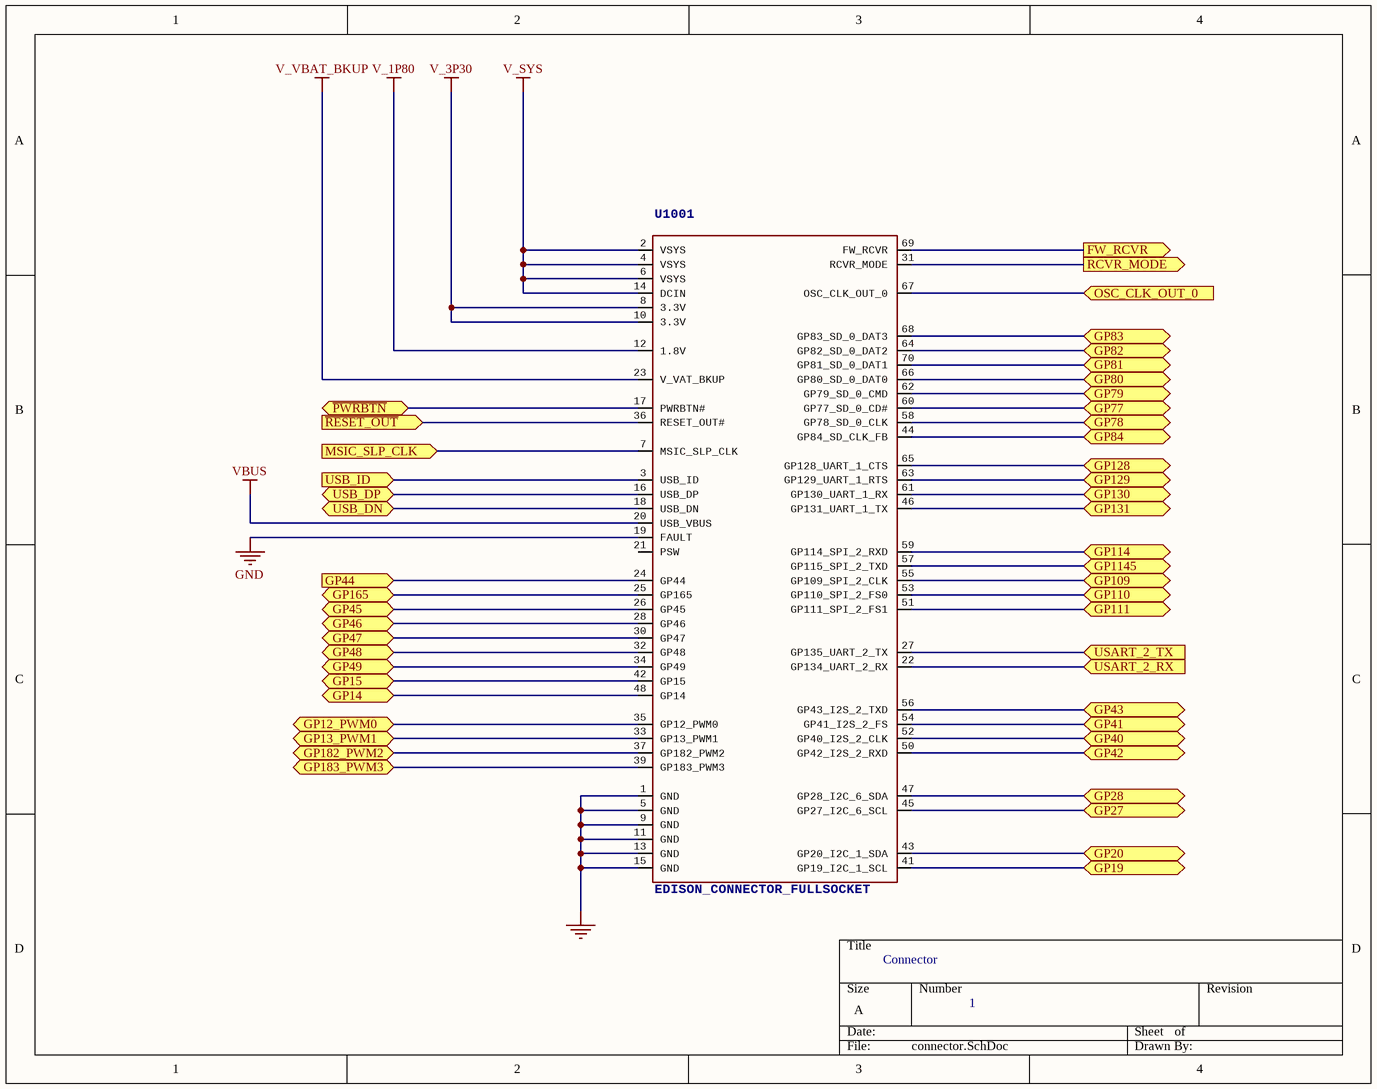
[diagram p5: connector.SchDoc]

### Parts
U1001  EDISON_CONNECTOR_FULLSOCKET  [EDISON_DAUGHTER_TOP]

### Ports
FW_RCVR (out), GP12_PWM0 (bidir), GP13_PWM1 (bidir), GP14 (bidir), GP15 (bidir), GP19 (bidir), GP20 (bidir), GP27 (bidir), GP28 (bidir), GP40 (bidir), GP41 (bidir), GP42 (bidir), GP43 (bidir), GP44 (in), GP45 (bidir), GP46 (bidir), GP47 (bidir), GP48 (bidir), GP49 (bidir), GP77 (bidir), GP78 (bidir), GP79 (bidir), GP80 (bidir), GP81 (bidir), GP82 (bidir), GP83 (bidir), GP84 (bidir), GP109 (bidir), GP110 (bidir), GP111 (bidir), GP114 (bidir), GP128 (bidir), GP129 (bidir), GP130 (bidir), GP131 (bidir), GP165 (bidir), GP182_PWM2 (bidir), GP183_PWM3 (bidir), GP1145 (bidir), MSIC_SLP_CLK (in), OSC_CLK_OUT_0 (in), RCVR_MODE (out), USART_2_RX (in), USART_2_TX (in), USB_DN (bidir), USB_DP (bidir), USB_ID (in), ~{PWRBTN} (bidir), ~{RESET_OUT} (in)

### Nets
GND: U1001.1(GND) U1001.5(GND) U1001.9(GND) U1001.11(GND) U1001.13(GND) U1001.15(GND) U1001.19(FAULT)
V_1P80: U1001.12(1.8V)
V_3P30: U1001.8(3.3V) U1001.10(3.3V)
V_SYS: U1001.2(VSYS) U1001.4(VSYS) U1001.6(VSYS) U1001.14(DCIN)
V_VBAT_BKUP: U1001.23(V_VAT_BKUP)
VBUS: U1001.20(USB_VBUS)
NetC2010_2: U1001.17(PWRBTN#) ; port ~{PWRBTN}
NetJ7_3: U1001.3(USB_ID) ; port USB_ID
NetJ7_7: U1001.7(MSIC_SLP_CLK) ; port MSIC_SLP_CLK
NetJ7_16: U1001.16(USB_DP) ; port USB_DP
NetJ7_18: U1001.18(USB_DN) ; port USB_DN
NetJ7_22: U1001.27(GP135_UART_2_TX) ; port USART_2_TX
NetJ7_24: U1001.24(GP44) ; port GP44
NetJ7_25: U1001.25(GP165) ; port GP165
NetJ7_26: U1001.26(GP45) ; port GP45
NetJ7_27: U1001.22(GP134_UART_2_RX) ; port USART_2_RX
NetJ7_28: U1001.28(GP46) ; port GP46
NetJ7_30: U1001.30(GP47) ; port GP47
NetJ7_31: U1001.31(RCVR_MODE) ; port RCVR_MODE
NetJ7_32: U1001.32(GP48) ; port GP48
NetJ7_33: U1001.33(GP13_PWM1) ; port GP13_PWM1
NetJ7_34: U1001.34(GP49) ; port GP49
NetJ7_35: U1001.35(GP12_PWM0) ; port GP12_PWM0
NetJ7_36: U1001.36(RESET_OUT#) ; port ~{RESET_OUT}
NetJ7_37: U1001.37(GP182_PWM2) ; port GP182_PWM2
NetJ7_39: U1001.39(GP183_PWM3) ; port GP183_PWM3
NetJ7_41: U1001.41(GP19_I2C_1_SCL) ; port GP19
NetJ7_42: U1001.42(GP15) ; port GP15
NetJ7_43: U1001.43(GP20_I2C_1_SDA) ; port GP20
NetJ7_44: U1001.44(GP84_SD_CLK_FB) ; port GP84
NetJ7_45: U1001.45(GP27_I2C_6_SCL) ; port GP27
NetJ7_46: U1001.46(GP131_UART_1_TX) ; port GP131
NetJ7_47: U1001.47(GP28_I2C_6_SDA) ; port GP28
NetJ7_48: U1001.48(GP14) ; port GP14
NetJ7_50: U1001.50(GP42_I2S_2_RXD) ; port GP42
NetJ7_51: U1001.51(GP111_SPI_2_FS1) ; port GP111
NetJ7_52: U1001.52(GP40_I2S_2_CLK) ; port GP40
NetJ7_53: U1001.53(GP110_SPI_2_FS0) ; port GP110
NetJ7_54: U1001.54(GP41_I2S_2_FS) ; port GP41
NetJ7_55: U1001.55(GP109_SPI_2_CLK) ; port GP109
NetJ7_56: U1001.56(GP43_I2S_2_TXD) ; port GP43
NetJ7_57: U1001.57(GP115_SPI_2_TXD) ; port GP1145
NetJ7_58: U1001.58(GP78_SD_0_CLK) ; port GP78
NetJ7_59: U1001.59(GP114_SPI_2_RXD) ; port GP114
NetJ7_60: U1001.60(GP77_SD_0_CD#) ; port GP77
NetJ7_61: U1001.61(GP130_UART_1_RX) ; port GP130
NetJ7_62: U1001.62(GP79_SD_0_CMD) ; port GP79
NetJ7_63: U1001.63(GP129_UART_1_RTS) ; port GP129
NetJ7_64: U1001.64(GP82_SD_0_DAT2) ; port GP82
NetJ7_65: U1001.65(GP128_UART_1_CTS) ; port GP128
NetJ7_66: U1001.66(GP80_SD_0_DAT0) ; port GP80
NetJ7_67: U1001.67(OSC_CLK_OUT_0) ; port OSC_CLK_OUT_0
NetJ7_68: U1001.68(GP83_SD_0_DAT3) ; port GP83
NetJ7_69: U1001.69(FW_RCVR) ; port FW_RCVR
NetJ7_70: U1001.70(GP81_SD_0_DAT1) ; port GP81

Not connected (* = marked no-connect by the designer): U1001 21(PSW)

### Notes on the sheet
- Connector
- 1

### Library data of the parts
U1001 = EDISON_CONNECTOR_FULLSOCKET: Supplier 1: Digi-Key; Supplier Part Number 1: H11630CT-ND

## Sheet i2c.SchDoc
size A
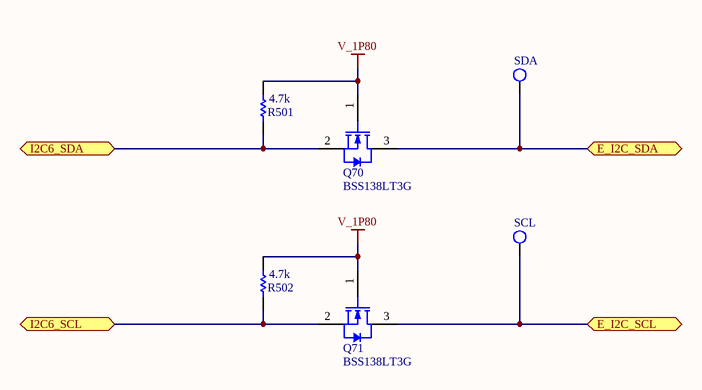
[diagram p6: i2c.SchDoc]

### Parts
Q70  BSS138LT3G  [ONSC-SOT-23-3-318-08_V]
Q71  BSS138LT3G  [ONSC-SOT-23-3-318-08_V]
R501  value 4.7k  [RESC0603(1608)_N]  (hidden comment: 4K7 5% 0603(1608))
R502  value 4.7k  [RESC0603(1608)_N]  (hidden comment: 4K7 5% 0603(1608))
SCL  Testpoint  [Tespoint_Keystone]  (value not drawn)
SDA  Testpoint  [Tespoint_Keystone]  (value not drawn)

### Ports
E_I2C_SCL (bidir), E_I2C_SDA (bidir), I2C6_SCL (bidir), I2C6_SDA (bidir)

### Nets
V_1P80: Q70.1(G) Q71.1(G) R501.2 R502.2
UART3_RX: Q70.3(D) SDA.1(TP) ; port E_I2C_SDA
UART3_TX: Q71.3(D) SCL.1(TP) ; port E_I2C_SCL
NetJ7_45: Q71.2(S) R502.1 ; port I2C6_SCL
NetJ7_47: Q70.2(S) R501.1 ; port I2C6_SDA

### Library data of the parts
Q70 Q71 = CMP-1058-00765-1: as Q9 on sheet power_supply; ComponentLink2URL: http://www.onsemi.com/pub_link/Collateral/BSS138LT1-D.PDF; PackageDescription: 3-Pin Small Outline Transistor, Body 2.92 x 1.3 mm, Pitch 0.95 mm; Package Type: SOT-23-3; Mounting Technology: Surface Mount; ComponentLink1Description: Manufacturer URL; PackageVersion: Rev. AP, 11/2009; ComponentLink3Description: Package Specification; DatasheetVersion: Rev. 8; RoHS: Pb-Free; Packing: Tape and Reel; PackageReference: SOT-23-3-318-08; PartNumber: BSS138LT3G; ComponentLink3URL: http://www.onsemi.cn/pub_link/Collateral/318-08.PDF; ComponentLink1URL: http://www.onsemi.com/; ComponentLink2Description: Datasheet; Supplier 1: Digi-Key; Supplier Part Number 1: BSS138LT1GOSCT-ND
R501 R502 = CMP-1012-00090-1: 4K7 0.1W 5% 0603 (1608 Metric)  SMD; Case-Metric: 1608; Case-EIA: 0603; Tolerance: 5 %; Technology: SMT; Power: 0.1 W; Supplier 1: Digi-Key; Supplier Part Number 1: P4.7KGCT-ND
SCL SDA = TestPoint: Supplier 1: Digi-Key; Supplier Part Number 1: 5000K-ND

## Sheet CopterControl 3D.SchDoc: CopterControl 3D
size A3; Author: David Ankers; DrawnBy: David Ankers; Engineer: David Ankers; Organization: The OpenPilot Project; DocumentNumber: 1; Revision: A; SheetNumber: 1; SheetTotal: 1; License: Creative Commons BY-SA; ProjectName: OpenPilot
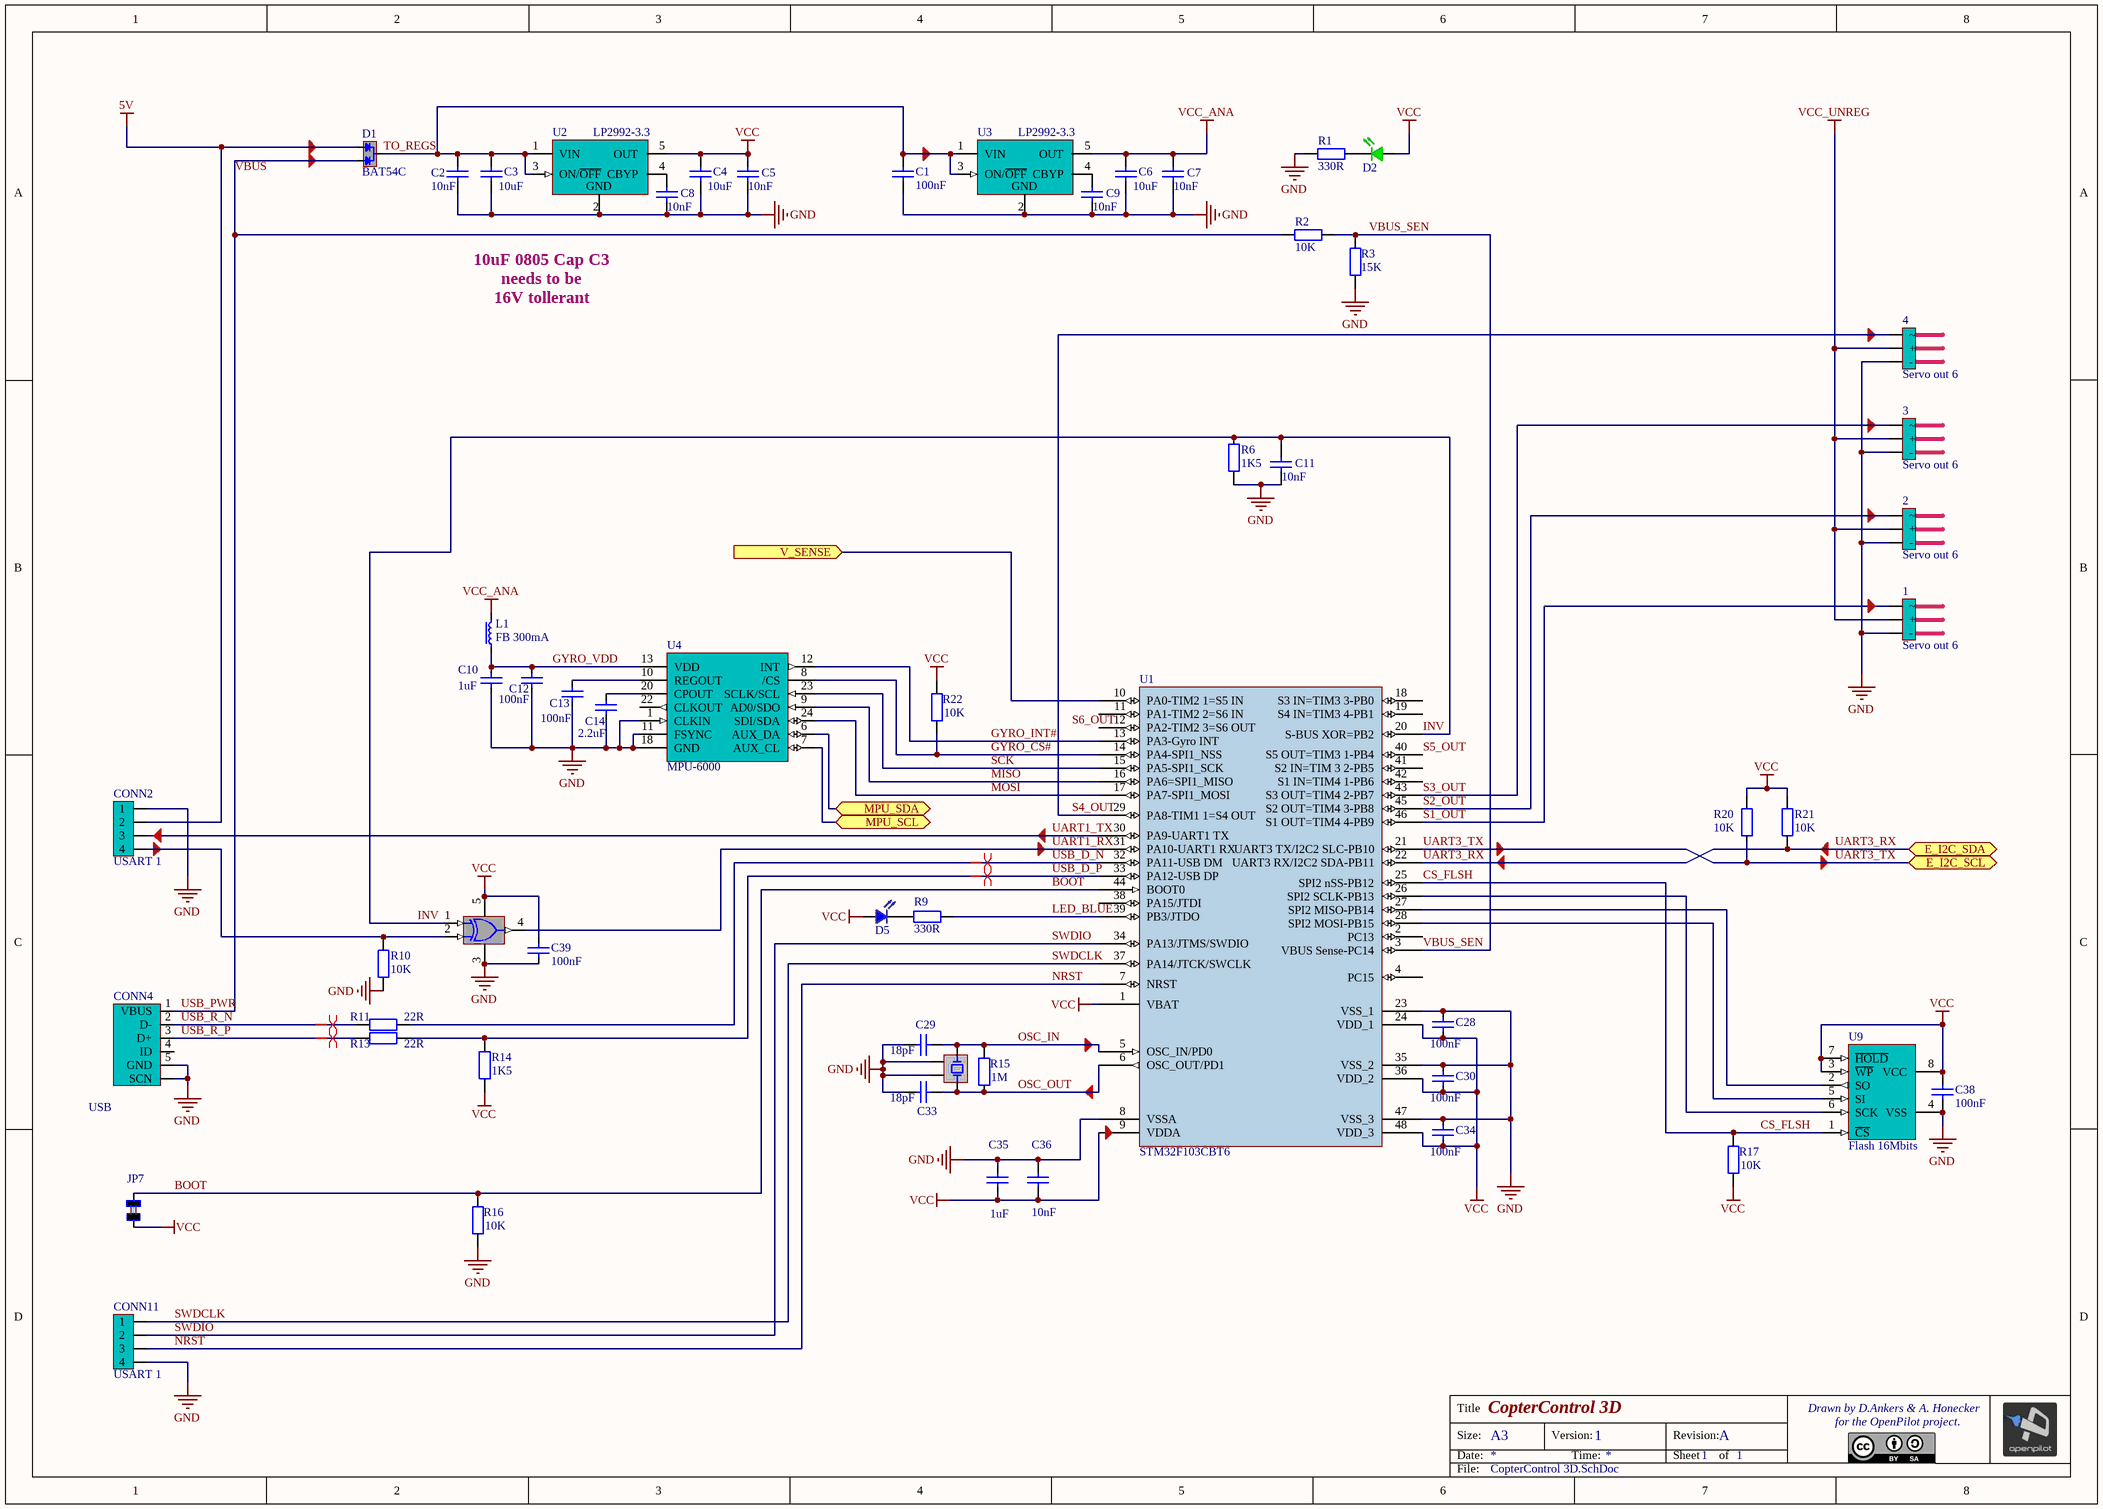
[diagram p7: CopterControl 3D.SchDoc]

### Parts
1  Servo out 6  [SIP3 - 0.1]
2  Servo out 6  [SIP3 - 0.1]
3  Servo out 6  [SIP3 - 0.1]
4  Servo out 6  [SIP3 - 0.1]
C1  value 100nF  [CAP603N]  (hidden comment: Cap603)
C2  value 10nF  [CAP603L]  (hidden comment: Cap603)
C3  value 10uF  [CAP805L]  (hidden comment: Cap805)
C4  value 10uF  [CAP805L]  (hidden comment: Cap805)
C5  value 10nF  [CAP603N]  (hidden comment: Cap603)
C6  value 10uF  [CAP805L]  (hidden comment: Cap805)
C7  value 10nF  [CAP603N]  (hidden comment: Cap603)
C8  value 10nF  [CAP603N]  (hidden comment: Cap603)
C9  value 10nF  [CAP603N]  (hidden comment: Cap603)
C10  value 1uF  [CAP603L]  (hidden comment: Cap603)
C11  value 10nF  [CAP603N]  (hidden comment: Cap603)
C12  value 100nF  [CAP603L]  (hidden comment: Cap603)
C13  value 100nF  [CAP603L]  (hidden comment: Cap603)
C14  value 2.2uF  [CAP603L]  (hidden comment: Cap603)
C28  value 100nF  [CAP603N]  (hidden comment: Cap603)
C29  value 18pF  [CAP603N]  (hidden comment: Cap603)
C30  value 100nF  [CAP603N]  (hidden comment: Cap603)
C33  value 18pF  [CAP603N]  (hidden comment: Cap603)
C34  value 100nF  [CAP603N]  (hidden comment: Cap603)
C35  value 1uF  [CAP603L]  (hidden comment: Cap603)
C36  value 10nF  [CAP603N]  (hidden comment: Cap603)
C38  value 100nF  [CAP603N]  (hidden comment: Cap603)
C39  value 100nF  [CAP603N]  (hidden comment: Cap603)
CONN2  USART 1  [JST SH 4 Pin Side Entry]
CONN4  USB  [USB SMD]
CONN11  USART 1  [JST SH 4 Pin Side Entry]
D1  BAT54C  [SOT23-3N]
D2  Green  [LED603N]  (value not drawn)
D5  Blue  [LED603N]  (value not drawn)
JP7  2 PAD Touch JMP  [TOUCH JMP 2PAD]  (value not drawn)
L1  FB 300mA  [IND603N]
R1  value 330R  [RES603N]  (hidden comment: Res603)
R2  value 10K  [RES603N]  (hidden comment: Res603)
R3  value 15K  [RES603N]  (hidden comment: Res603)
R6  value 1K5  [RES603N]  (hidden comment: Res603)
R9  value 330R  [RES603N]  (hidden comment: Res603)
R10  value 10K  [RES603N]  (hidden comment: Res603)
R11  value 22R  [RES603N]  (hidden comment: Res603)
R13  value 22R  [RES603N]  (hidden comment: Res603)
R14  value 1K5  [RES603N]  (hidden comment: Res603)
R15  value 1M  [RES603N]  (hidden comment: Res603)
R16  value 10K  [RES603N]  (hidden comment: Res603)
R17  value 10K  [RES603N]  (hidden comment: Res603)
R20  value 10K  [RES603N]  (hidden comment: Res603)
R21  value 10K  [RES603N]  (hidden comment: Res603)
R22  value 10K  [RES603N]  (hidden comment: Res603)
U1  STM32F103CBT6  [STM32 48 Lead]
U2  LP2992-3.3  [SOT23-5L]
U3  LP2992-3.3  [SOT23-5L]
U4  MPU-6000  [IMU-3000]
U6  XOR  [DCK-5]  (value not drawn)
U9  Flash 16Mbits  [SOIC8_N]
X1  8MHz  [XTAL ACT530SMX-4 Series]  (value not drawn)

### Ports
E_I2C_SCL (bidir), E_I2C_SDA (bidir), MPU_SCL (bidir), MPU_SDA (bidir), V_SENSE (in)

### Nets
5V: CONN2.2 D1.2(A2)
GND: 1.3(-) 2.3(-) 3.3(-) 4.3(-) C1.2 C2.2 C3.2 C4.2 C5.2 C6.2 C7.2 C8.2 C9.2 C10.2 C11.2 C12.2 C13.2 C14.1 C28.1 C29.1 C30.1 C33.1 C34.1 C35.2 C36.1 C38.2 C39.2 CONN2.1 CONN4.0(SCN) CONN4.5(GND) CONN11.4 R1.1 R3.1 R6.1 R10.1 R16.1 U1.8(VSSA) U1.23(VSS_1) U1.35(VSS_2) U1.47(VSS_3) U2.2(GND) U3.2(GND) U4.1(CLKIN) U4.11(FSYNC) U4.18(GND) U6.3(GND) U9.4(VSS) X1.2 X1.4
VCC: C4.1 C5.1 C28.2 C30.2 C34.2 C35.1 C36.2 C38.1 C39.1 D2.2(A) D5.2(A) JP7.2 R14.1 R17.1 R20.2 R21.2 R22.2 U1.1(VBAT) U1.9(VDDA) U1.24(VDD_1) U1.36(VDD_2) U1.48(VDD_3) U2.5(OUT) U6.5(VCC) U9.3(~{WP}) U9.7(~{HOLD}) U9.8(VCC)
VCC_ANA: C6.1 C7.1 L1.2 U3.5(OUT)
VCC_UNREG: 1.2(+) 2.2(+) 3.2(+) 4.2(+)
BOOT: JP7.1 R16.2 U1.44(BOOT0)
CS_FLSH: R17.2 U1.25(SPI2_nSS-PB12) U9.1(~{CS})
GYRO_CS#: R22.1 U1.14(PA4-SPI1_NSS) U4.8(/CS)
GYRO_INT#: U1.13(PA3-Gyro_INT) U4.12(INT)
GYRO_VDD: C10.1 C12.1 L1.1 U4.13(VDD)
INV: C11.1 R6.2 U1.20(S-BUS_XOR=PB2) U6.1(A)
LED_BLUE: R9.2 U1.39(PB3/JTDO)
MISO: U1.16(PA6=SPI1_MISO) U4.9(AD0/SDO)
MOSI: U1.17(PA7-SPI1_MOSI) U4.24(SDI/SDA)
NRST: CONN11.3 U1.7(NRST)
OSC_IN: C29.2 R15.2 U1.5(OSC_IN/PD0) X1.3
OSC_OUT: C33.2 R15.1 U1.6(OSC_OUT/PD1) X1.1
S1_OUT: 1.1 U1.46(S1_OUT=TIM4_4-PB9)
S2_OUT: 2.1 U1.45(S2_OUT=TIM4_3-PB8)
S3_OUT: 3.1 U1.43(S3_OUT=TIM4_2-PB7)
S4_OUT: 4.1 U1.29(PA8-TIM1_1=S4_OUT)
S5_OUT: U1.40(S5_OUT=TIM3_1-PB4)
SCK: U1.15(PA5-SPI1_SCK) U4.23(SCLK/SCL)
SWDCLK: CONN11.1 U1.37(PA14/JTCK/SWCLK)
SWDIO: CONN11.2 U1.34(PA13/JTMS/SWDIO)
TO_REGS: C1.1 C2.1 C3.1 D1.3(COM) U2.1(VIN) U2.3(ON/~{OFF}) U3.1(VIN) U3.3(ON/~{OFF})
UART1_RX: U1.31(PA10-UART1_RX) U6.4(Y)
UART1_TX: CONN2.3 U1.30(PA9-UART1_TX)
UART3_RX: R21.1 U1.22(UART3_RX/I2C2_SDA-PB11) ; port E_I2C_SDA
UART3_TX: R20.1 U1.21(UART3_TX/I2C2_SLC-PB10) ; port E_I2C_SCL
USB_D_N: R11.1 U1.32(PA11-USB_DM)
USB_D_P: R13.1 R14.2 U1.33(PA12-USB_DP)
USB_PWR: CONN4.1(VBUS) D1.1(A1) R2.1  [also labelled VBUS]
USB_R_N: CONN4.2(D-) R11.2
USB_R_P: CONN4.3(D+) R13.2
VBUS_SEN: R2.2 R3.2 U1.3(VBUS_Sense-PC14)
NetC8_1: C8.1 U2.4(CBYP)
NetC9_1: C9.1 U3.4(CBYP)
NetC13_1: C13.1 U4.10(REGOUT)
NetC14_2: C14.2 U4.20(CPOUT)
NetCONN2_4: CONN2.4 R10.2 U6.2(B)
NetD2_1: D2.1(K) R1.2
NetD5_1: D5.1(K) R9.1
NetMG1_1: U4.7(AUX_CL) ; port MPU_SCL
NetMG1_16: U4.6(AUX_DA) ; port MPU_SDA
NetR2000_2: U1.10(PA0-TIM2_1=S5_IN) ; port V_SENSE
NetU1_26: U1.26(SPI2_SCLK-PB13) U9.6(SCK)
NetU1_27: U1.27(SPI2_MISO-PB14) U9.2(SO)
NetU1_28: U1.28(SPI2_MOSI-PB15) U9.5(SI)

Not connected (* = marked no-connect by the designer): CONN4 4(ID); U1 2(PC13) 4(PC15) 11(PA1-TIM2_2=S6_IN) 12(PA2-TIM2_3=S6_OUT) 18(S3_IN=TIM3_3-PB0) 19(S4_IN=TIM3_4-PB1) 38(PA15/JTDI) 41(S2_IN=TIM_3_2-PB5) 42(S1_IN=TIM4_1-PB6); U4 2(NC) 3(NC) 4(NC) 5(NC) 14(NC) 15(NC) 16(NC) 17(NC) 19(RESV) 21(RESV) 22(CLKOUT)

### Layout directives
differential pair: USB_D_N, USB_D_P, USB_R_N, USB_R_P

### Notes on the sheet
- 10uF 0805 Cap C3
  needs to be
  16V tollerant
- Title
- Size:
- Date:
- A3
- Version:
- Time:
- Revision:
- Sheet
- of
- Drawn by D.Ankers & A. Honecker
- for the OpenPilot project.
- File:
- Labels drawn without touching a wire or pin: S6_OUT

### Library data of the parts
1-4 = Hdr 3 Pin 0.1: Header, 3-Pin, 0.1"; Manufacturer: Generic Components; Class: Connector; Supplier 1: Digi-Key; Supplier Part Number 1: MTLW-103-23-S-S-260-ND
C1 C2 C5 C7-C14 C28-C30 C33-C36 C38 C39 = Cap603: Capacitor SMD; Published: 1-Nov-2010; LatestRevisionDate: 1-Nov-2010; LatestRevisionNote: Released OpenPilot Lib; PackageReference: 0603 (1608 Metric); Publisher: The OpenPilot Project; Supplier 1: Digi-Key
  C1 C12 C13 C28 C30 C34 C38: Supplier Part Number 1: 399-5089-1-ND
  C2 C5 C7-C9 C11 C36: Supplier Part Number 1: 399-1091-1-ND
  C10: Supplier Part Number 1: 445-1415-1-ND
  C14: Supplier Part Number 1: 445-5175-1-ND
  C29 C33: Supplier Part Number 1: 399-1052-1-ND
  C35: Supplier Part Number 1: 311-1446-1-ND
  C39: Supplier Part Number 1: 399-5089-1-ND; Supplier 2: Digi-Key; Supplier Part Number 2: 399-7844-1-ND
C3 C4 C6 = Cap805: Capacitor SMD; Published: 1-Nov-2010; LatestRevisionDate: 1-Nov-2010; LatestRevisionNote: Released OpenPilot Lib; PackageReference: 0805 (2012 Metric); Publisher: The OpenPilot Project; Supplier 1: Digi-Key; Supplier Part Number 1: 490-5523-1-ND
CONN2 = JST-SH 4-pin Side Entry Socket: Manufacturer: Generic Components; Class: Connector; Supplier 1: Digi-Key; Supplier Part Number 1: 455-1804-1-ND
CONN4 = USB_SMT_B: USB Type-B SMT Socket; Class: Connector; Supplier 1: Digi-Key; Supplier Part Number 1: 670-1190-1-ND
CONN11 = JST-SH 4-pin Side Entry Socket: pin to pad: 1>4 2>3 3>2 4>1; Manufacturer: Generic Components; Class: Connector; Supplier 1: Digi-Key; Supplier Part Number 1: 455-1804-1-ND
D1 = BAT54C: Dual Diode Command Cathode; Supplier 1: Digi-Key; Supplier Part Number 1: 497-3786-1-ND
D2 = LED 603 Gr: Green 603 LED; Value: 2.1v 20mA; Supplier 1: Digi-Key; Supplier Part Number 1: 754-1116-1-ND
D5 = LED 603 Bl: Blue 603 LED; Supplier 1: Digi-Key; Supplier Part Number 1: 350-2037-1-ND
JP7 = 2 PAD Touch JMP: 2 Pad Touch Jumper; LatestRevisionDate: 1-Nov-2010; LatestRevisionNote: Released OpenPilot Lib; Published: 1-Nov-2010; Publisher: The OpenPilot Project
L1 = FerriteBead_300mA: Ferrite Bead 300mA; Manufacturer: Generic Components; Class: Passive; Supplier 1: Digi-Key; Supplier Part Number 1: 732-1586-1-ND
R1-R3 R6 R9-R11 R13-R17 R20-R22 = Res603: Resistor SMD; Published: 1-Nov-2010; LatestRevisionDate: 1-Nov-2010; LatestRevisionNote: Released OpenPilot Lib; PackageReference: 0402 (1005 Metric); Publisher: The OpenPilot Project; Supplier 1: Digi-Key
  R1 R9: Supplier Part Number 1: P330HCT-ND
  R2 R10 R16 R17 R20-R22: Supplier Part Number 1: P10.0KHCT-ND
  R3: Supplier Part Number 1: P15.0KHCT-ND
  R6 R14: Supplier Part Number 1: P1.50KHCT-ND
  R11 R13: Supplier Part Number 1: P22GCT-ND
  R15: Supplier Part Number 1: P1.0MGCT-ND
U1 = STM32F103CBT6: STM32 ARM-based 32-bit MCU with 128 Kbytes Flash, 48-pin LQFP, Industrial Temperature; Published: 30-May-2008; DatasheetVersion: rev6, Mar-2008; PackageVersion: Mar-2008; PackageReference: LQFP48; Publisher: Altium Limited; PackageDescription: 48-Pin Low-Profile Quad Flat Pack, 7 x 7 mm Body, 0.5 mm Pitch (LQFP48); ComponentLink1Description: Manufacturer Link; ComponentLink1URL: www.st.com/stm32; ComponentLink2Description: Datasheet; ComponentLink2URL: http://www.st.com/stonline/products/literature/ds/13587.pdf; Supplier 1: Digi-Key; Supplier Part Number 1: 497-6288-ND
U2 U3 = LP2985-3.3: 3.3V 250mA LDO Regulator; Manufacturer: National Semiconductor; Manufacturer Part Number: LP2992AIM5-3.3/NOPB; Regulator Topology: Positive Fixed; Voltage - Input: Up to 16V; Voltage - Dropout (Typical): 0.45V @ 250mA; Number of Regulators: 1; RoHS: RoHS Compliant; Category: Integrated Circuits (ICs); Voltage - Output: 3.3V; Current - Output: 250mA; Current - Limit (Min): -; Operating Temperature: -40°C ~ 125°C; Mounting Type: Surface Mount; Package / Case: SC-74A, SOT-753; Supplier Device Package: SOT-23-5; Packaging: Cut Tape (CT); ComponentLink1URL: http://www.national.com/ds/LP/LP2992.pdf; ComponentLink1Description: http://www.national.com/ds/LP/LP2992.pdf; Supplier 1: Digi-Key; Supplier Part Number 1: LP2992AIM5-3.3/NOPBCT-ND
U4 = MPU-3/6000: Invensense MPU-3/6000,  3-axis Gyros & Accel on 6000; ComponentLink2Description: Datasheet; LatestRevisionDate: 1-Nov-2010; LatestRevisionNote: Released OpenPilot Lib; Published: 1-Nov-2010; Publisher: The OpenPilot Project; Manufacturer: Invensense; Supplier 1: Digi-Key; Supplier Part Number 1: 1428-1005-1-ND
U6 = XOR SN74LVC1G86DCKR: XOR Gate SN74LVC1G86DCKR; Supplier 1: Digi-Key; Supplier Part Number 1: 296-9854-1-ND
U9 = Flash 16Mb 75MHZ 8SOIC: 16Mbit SPI Flash Memory; ComponentLink2Description: Datasheet; LatestRevisionDate: 1-Nov-2010; LatestRevisionNote: Released OpenPilot Lib; Published: 1-Nov-2010; Publisher: The OpenPilot Project; Supplier 1: Digi-Key; Supplier Part Number 1: M25P16-VMN6P-ND
X1 = XTAL ACT530SMX-4: Surface Mount Quartz Crystal, Digikey 535-9720-1-ND; Class: Oscillator; SubClass: Crystal Oscillator; Supplier 1: Digi-Key; Supplier Part Number 1: 535-9720-1-ND

## Sheet cc3d_addons.SchDoc
size A
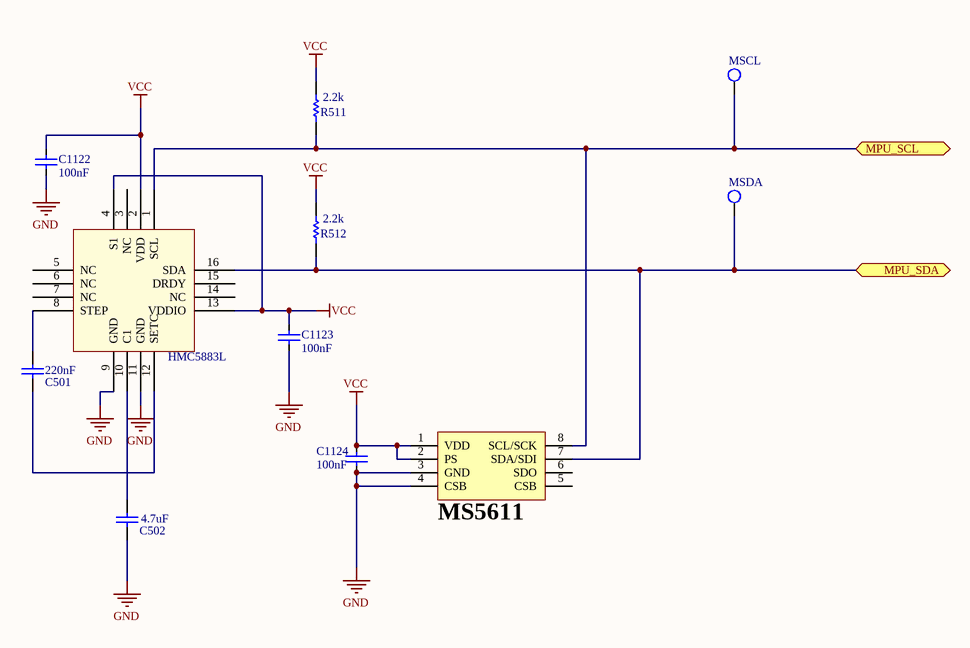
[diagram p8: cc3d_addons.SchDoc]

### Parts
C501  value 220nF  [CAPC0603(1608)100_M]  (hidden comment: CAP 220nF 6.3V 0603(1608))
C502  value 4.7uF  [CAPC0402(1005)60_L]  (hidden comment: CAP 4.7uF 6.3V 0402(1005))
C1122  value 100nF  [CAP603L]  (hidden comment: Cap603)
C1123  value 100nF  [CAP603L]  (hidden comment: Cap603)
C1124  value 100nF  [CAP603L]  (hidden comment: Cap603)
MG1  HMC5883L  [HMC5883L]
MS1  MS5611  [MS5611]
MSCL  TestPoint  [Tespoint_Keystone]  (value not drawn)
MSDA  Testpoint  [Tespoint_Keystone]  (value not drawn)
R511  value 2.2k  [RESC0603(1608)_L]  (hidden comment: 2K2 1% 0603(1608))
R512  value 2.2k  [RESC0603(1608)_L]  (hidden comment: 2K2 1% 0603(1608))

### Ports
MPU_SCL (bidir), MPU_SDA (bidir)

### Nets
GND: C502.1 C1122.1 C1123.1 C1124.1 MG1.9(GND) MG1.11(GND) MS1.3(GND) MS1.4(CSB)
VCC: C1122.2 C1123.2 C1124.2 MG1.2(VDD) MG1.4(S1) MG1.13(VDDIO) MS1.1(VDD) MS1.2(PS) R511.2 R512.2
NetC501_1: C501.1 MG1.12(SETC)
NetC501_2: C501.2 MG1.8(STEP)
NetC502_2: C502.2 MG1.10(C1)
NetMG1_1: MG1.1(SCL) MS1.8(SCL/SCK) MSCL.1(TP) R511.1 ; port MPU_SCL
NetMG1_16: MG1.16(SDA) MS1.7(SDA/SDI) MSDA.1(TP) R512.1 ; port MPU_SDA

Not connected (* = marked no-connect by the designer): MG1 3(NC) 5(NC) 6(NC) 7(NC) 14(NC) 15(DRDY); MS1 5(CSB) 6(SDO)

### Library data of the parts
C501 = CMP-1035-02636-1: CAP 220nF 6.3V ±10% 0603 (1608 Metric) Thickness 1mm SMD; Case-EIA: 0603; Case-Metric: 1608; Technology: SMT; Max Thickness: 1 mm; Rated Voltage: 6.3 V; Tolerance: ±10%; Supplier 1: Digi-Key; Supplier Part Number 1: 399-9046-1-ND
C502 = CMP-1034-02136-1: CAP 4.7uF 6.3V ±10% 0402 (1005 Metric) Thickness 0.6mm SMD; Case-EIA: 0402; Case-Metric: 1005; Tolerance: ±10%; Technology: SMT; Max Thickness: 0.6 mm; Rated Voltage: 6.3 V; Supplier 1: Digi-Key; Supplier Part Number 1: 445-5947-1-ND
C1122-C1124 = Cap603: Capacitor SMD; Published: 1-Nov-2010; LatestRevisionDate: 1-Nov-2010; LatestRevisionNote: Released OpenPilot Lib; PackageReference: 0603 (1608 Metric); Publisher: The OpenPilot Project; Supplier 1: Digi-Key; Supplier Part Number 1: 399-5089-1-ND
MS1 = MS5611: Sensor
R511 R512 = CMP-1012-00546-1: 2K2 0.1W 1% 0603 (1608 Metric)  SMD; Case-EIA: 0603; Case-Metric: 1608; Tolerance: 1 %; Power: 0.1 W; Technology: SMT; Supplier 1: Digi-Key; Supplier Part Number 1: 311-2.20KHRCT-ND
MG1 = HMC5883L: Supplier 1: Digi-Key; Supplier Part Number 1: 342-1082-1-ND
MSCL MSDA = TestPoint: Supplier 1: Digi-Key; Supplier Part Number 1: 5000K-ND

## Sheet battery_monitor.SchDoc
size A
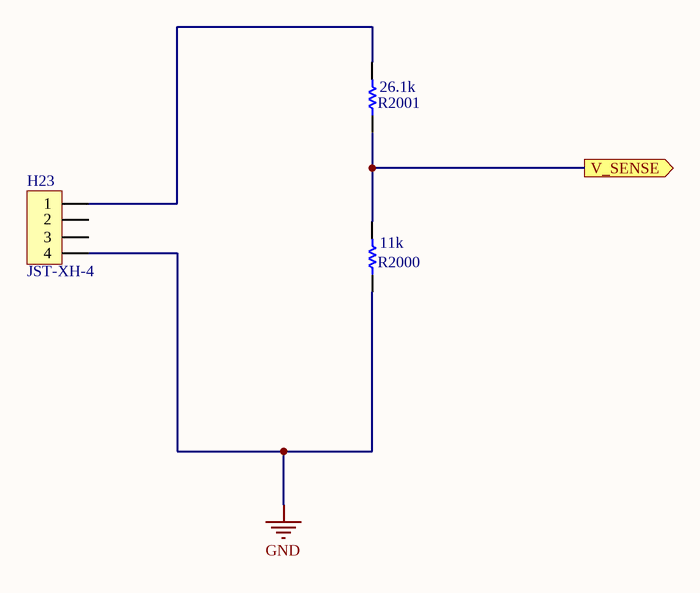
[diagram p9: battery_monitor.SchDoc]

### Parts
H23  JST-XH-4  [JST-XH-4]
R2000  value 11k  [RESC0805(2012)_M]  (hidden comment: 11K 1% 0805(2012))
R2001  value 26.1k  [RESC0805(2012)_N]  (hidden comment: 26K1 1% 0805(2012))

### Ports
V_SENSE (out)

### Nets
GND: H23.4 R2000.1
NetH23_1: H23.1 R2001.2
NetR2000_2: R2000.2 R2001.1 ; port V_SENSE

Not connected (* = marked no-connect by the designer): H23 2 3

### Library data of the parts
R2000 = CMP-1013-00627-1: 11K 0.125W 1% 0805 (2012 Metric)  SMD; Case-Metric: 2012; Case-EIA: 0805; Tolerance: 1 %; Technology: SMT; Power: 0.125 W; Supplier 1: Digi-Key; Supplier Part Number 1: 311-11.0KCRCT-ND
R2001 = CMP-1013-00668-1: 26K1 0.125W 1% 0805 (2012 Metric)  SMD; Case-Metric: 2012; Case-EIA: 0805; Tolerance: 1 %; Power: 0.125 W; Technology: SMT; Supplier 1: Digi-Key; Supplier Part Number 1: 311-26.1KCRCT-ND
H23 = JST-XH-4: Supplier 1: Digi-Key; Supplier Part Number 1: 455-2262-1-ND

## Nets that join several sheets
5V: power_supply (10 pins), CopterControl 3D (CONN2.2 D1.2)
GND: buttons_and_io_connector (9 pins), power_supply (19 pins), uart_to_usb_debug (11 pins), usb (Power.0 Power.5), connector (7 pins), CopterControl 3D (49 pins), cc3d_addons (8 pins), battery_monitor (H23.4 R2000.1)
V_1P80: buttons_and_io_connector (J7.12), uart_to_usb_debug (C1001.1 U201.1), connector (U1001.12), i2c (Q70.1 Q71.1 R501.2 R502.2)
V_3P30: buttons_and_io_connector (J7.8 J7.10), connector (U1001.8 U1001.10)
V_SYS: buttons_and_io_connector (5 pins), power_supply (5 pins), connector (U1001.2 U1001.4 U1001.6 U1001.14)
V_VBAT_BKUP: buttons_and_io_connector (J7.23), connector (U1001.23)
VBUS: buttons_and_io_connector (J7.20), power_supply (C56.1 U100.8), usb (Power.1), connector (U1001.20)
VCC: CopterControl 3D (27 pins), cc3d_addons (10 pins)
VCC_UNREG: power_supply (C57.1 U100.6), CopterControl 3D (1.2 2.2 3.2 4.2)
NetC2010_2: buttons_and_io_connector (C2010.2 J7.17 R47.2), connector (U1001.17)
NetJ7_3: buttons_and_io_connector (J7.3), usb (Power.4), connector (U1001.3)
NetJ7_7: buttons_and_io_connector (J7.7), connector (U1001.7)
NetJ7_16: buttons_and_io_connector (J7.16), usb (Power.3), connector (U1001.16)
NetJ7_18: buttons_and_io_connector (J7.18), usb (Power.2), connector (U1001.18)
NetJ7_22: buttons_and_io_connector (J7.22), uart_to_usb_debug (TP3.1 U201.30), connector (U1001.27)
NetJ7_24: buttons_and_io_connector (J7.24), uart_to_usb_debug (TP5.1 U201.32), connector (U1001.24)
NetJ7_25: buttons_and_io_connector (J7.25), uart_to_usb_debug (U201.8), connector (U1001.25)
NetJ7_26: buttons_and_io_connector (J7.26), connector (U1001.26)
NetJ7_27: buttons_and_io_connector (J7.27), uart_to_usb_debug (TP4.1 U201.2), connector (U1001.22)
NetJ7_28: buttons_and_io_connector (J7.28), connector (U1001.28)
NetJ7_30: buttons_and_io_connector (J7.30), connector (U1001.30)
NetJ7_31: buttons_and_io_connector (J7.31), connector (U1001.31)
NetJ7_32: buttons_and_io_connector (J7.32), connector (U1001.32)
NetJ7_33: buttons_and_io_connector (J7.33), connector (U1001.33)
NetJ7_34: buttons_and_io_connector (J7.34), connector (U1001.34)
NetJ7_35: buttons_and_io_connector (J7.35), connector (U1001.35)
NetJ7_36: buttons_and_io_connector (J7.36), connector (U1001.36)
NetJ7_37: buttons_and_io_connector (J7.37), connector (U1001.37)
NetJ7_39: buttons_and_io_connector (J7.39), connector (U1001.39)
NetJ7_41: buttons_and_io_connector (J7.41), connector (U1001.41)
NetJ7_42: buttons_and_io_connector (J7.42), connector (U1001.42)
NetJ7_43: buttons_and_io_connector (J7.43), connector (U1001.43)
NetJ7_44: buttons_and_io_connector (J7.44), connector (U1001.44)
NetJ7_45: buttons_and_io_connector (J7.45), connector (U1001.45), i2c (Q71.2 R502.1)
NetJ7_46: buttons_and_io_connector (J7.46), connector (U1001.46)
NetJ7_47: buttons_and_io_connector (J7.47), connector (U1001.47), i2c (Q70.2 R501.1)
NetJ7_48: buttons_and_io_connector (J7.48), connector (U1001.48)
NetJ7_50: buttons_and_io_connector (J7.50), connector (U1001.50)
NetJ7_51: buttons_and_io_connector (J7.51), connector (U1001.51)
NetJ7_52: buttons_and_io_connector (J7.52), connector (U1001.52)
NetJ7_53: buttons_and_io_connector (J7.53), connector (U1001.53)
NetJ7_54: buttons_and_io_connector (J7.54), connector (U1001.54)
NetJ7_55: buttons_and_io_connector (J7.55), connector (U1001.55)
NetJ7_56: buttons_and_io_connector (J7.56), connector (U1001.56)
NetJ7_57: buttons_and_io_connector (J7.57), connector (U1001.57)
NetJ7_58: buttons_and_io_connector (J7.58), connector (U1001.58)
NetJ7_59: buttons_and_io_connector (J7.59), connector (U1001.59)
NetJ7_60: buttons_and_io_connector (J7.60), connector (U1001.60)
NetJ7_61: buttons_and_io_connector (J7.61), connector (U1001.61)
NetJ7_62: buttons_and_io_connector (J7.62), connector (U1001.62)
NetJ7_63: buttons_and_io_connector (J7.63), connector (U1001.63)
NetJ7_64: buttons_and_io_connector (J7.64), connector (U1001.64)
NetJ7_65: buttons_and_io_connector (J7.65), connector (U1001.65)
NetJ7_66: buttons_and_io_connector (J7.66), connector (U1001.66)
NetJ7_67: buttons_and_io_connector (J7.67), connector (U1001.67)
NetJ7_68: buttons_and_io_connector (J7.68), connector (U1001.68)
NetJ7_69: buttons_and_io_connector (J7.69), connector (U1001.69)
NetJ7_70: buttons_and_io_connector (J7.70), connector (U1001.70)
NetMG1_1: CopterControl 3D (U4.7), cc3d_addons (MG1.1 MS1.8 MSCL.1 R511.1)
NetMG1_16: CopterControl 3D (U4.6), cc3d_addons (MG1.16 MS1.7 MSDA.1 R512.1)
NetR2000_2: CopterControl 3D (U1.10), battery_monitor (R2000.2 R2001.1)
UART3_RX: i2c (Q70.3 SDA.1), CopterControl 3D (R21.1 U1.22)
UART3_TX: i2c (Q71.3 SCL.1), CopterControl 3D (R20.1 U1.21)